# EAGLE board EEG_v2_0 (EAGLE 9.5.2), part 1 of 2
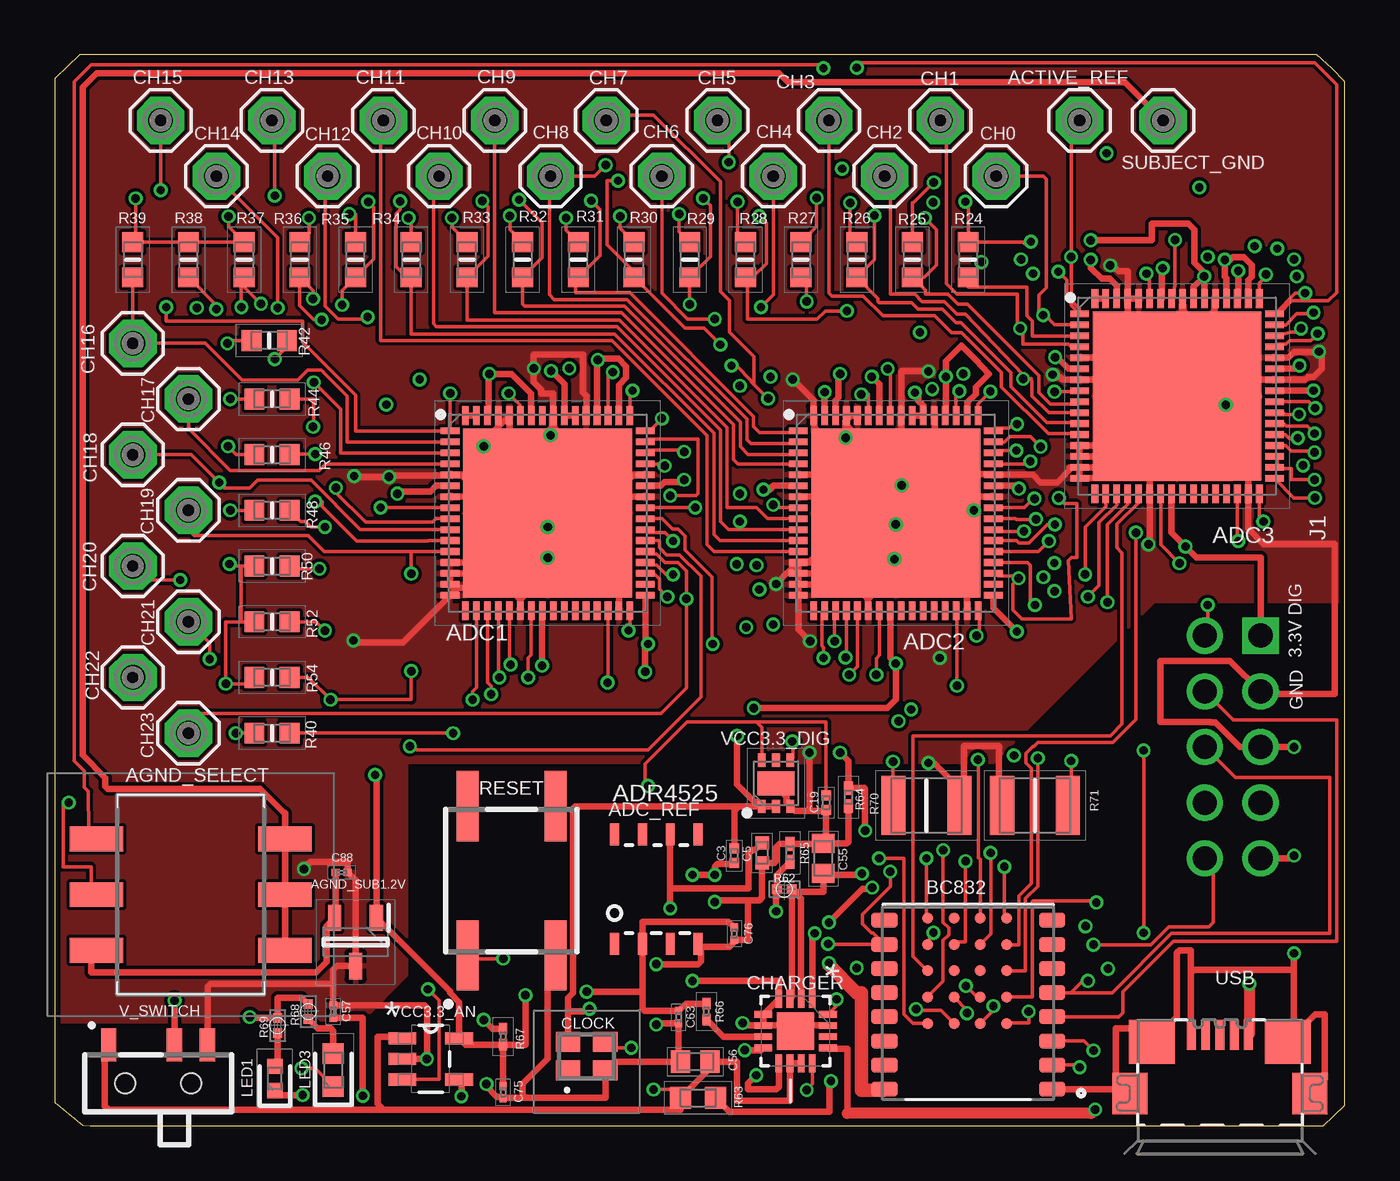
[diagram p2: board, top side]
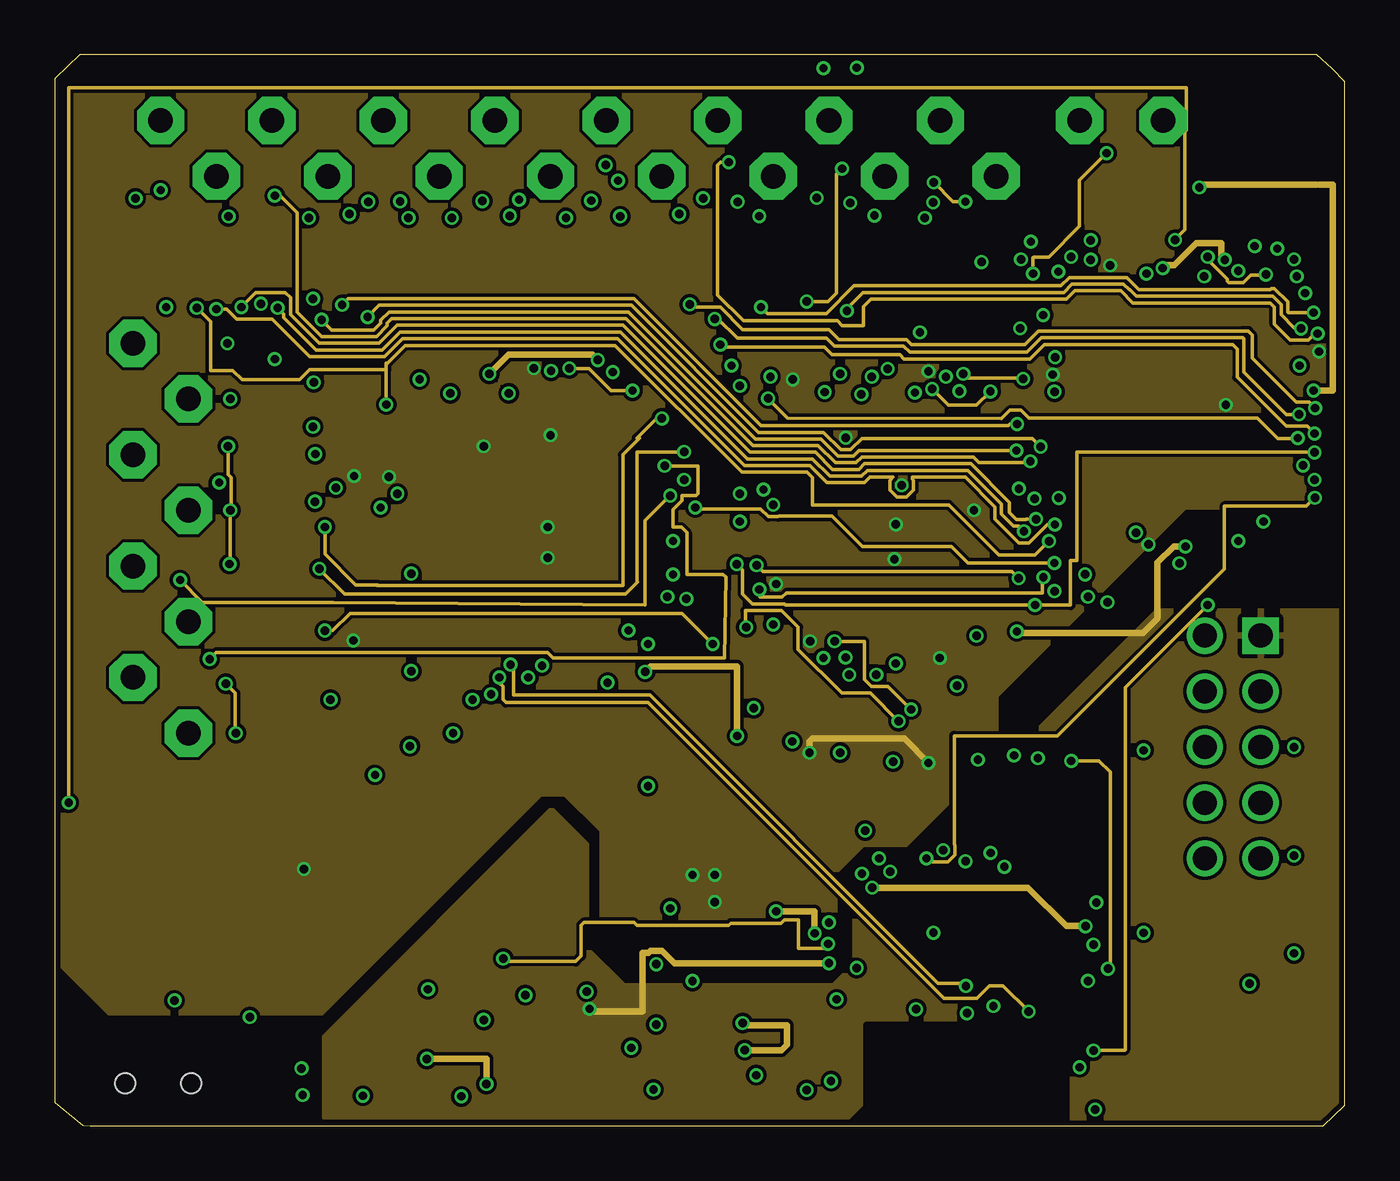
[diagram p3: board, inner layer Route2]
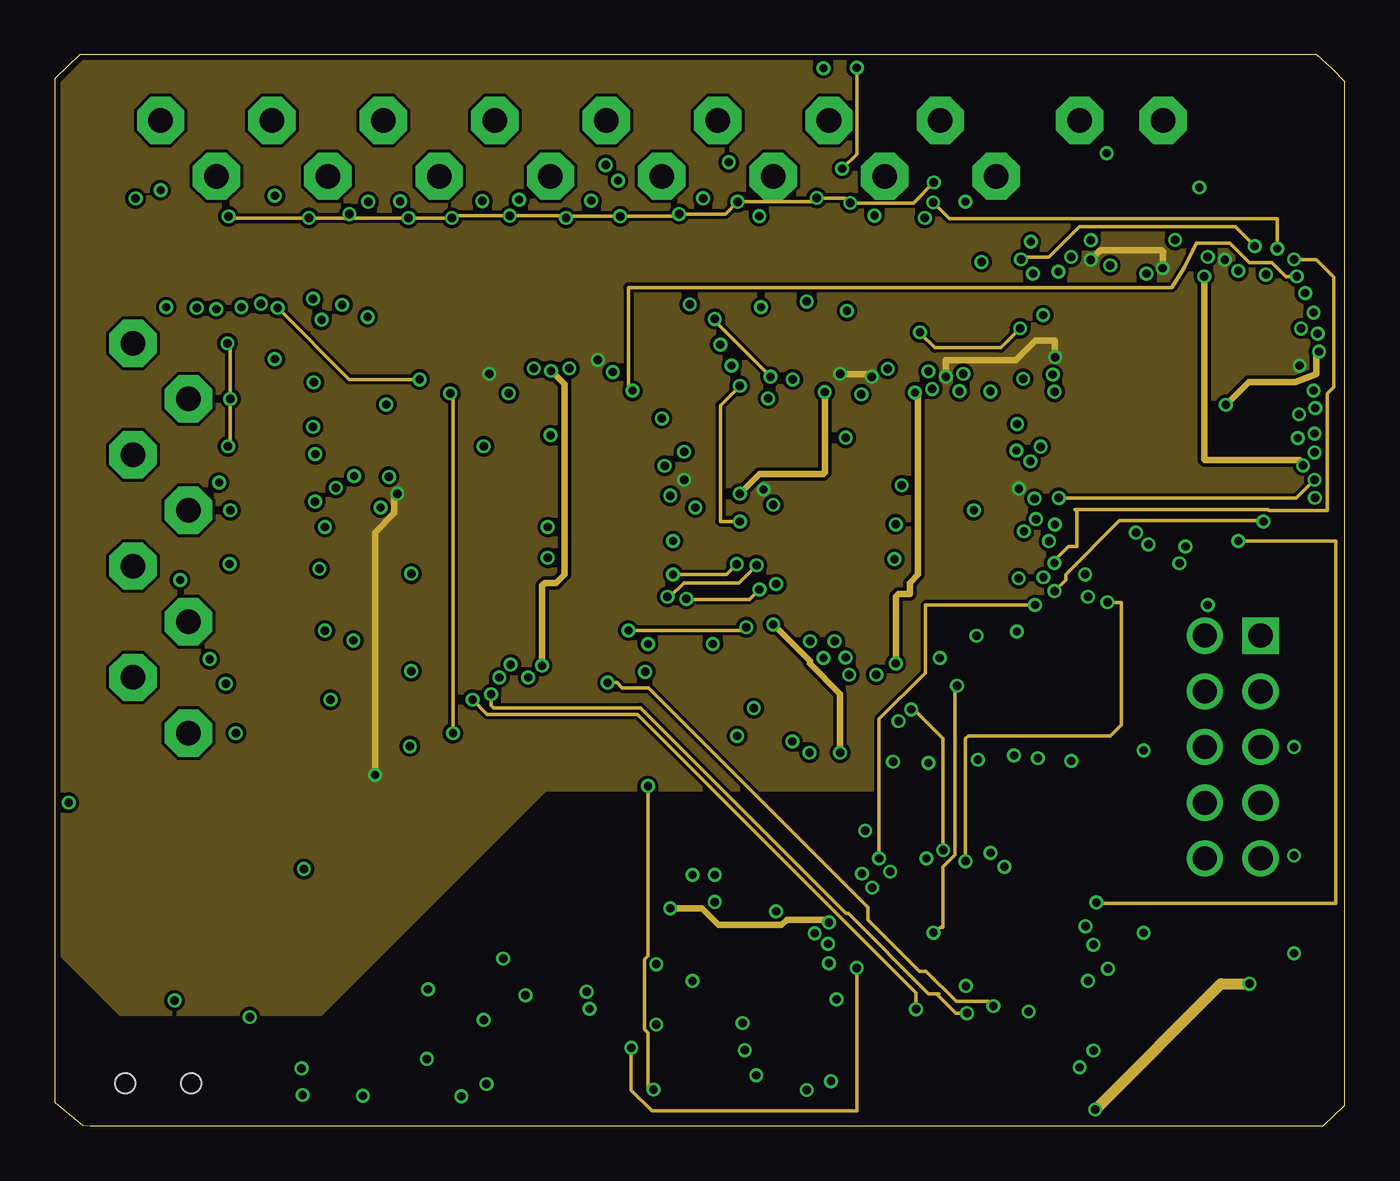
[diagram p4: board, inner layer Route15]
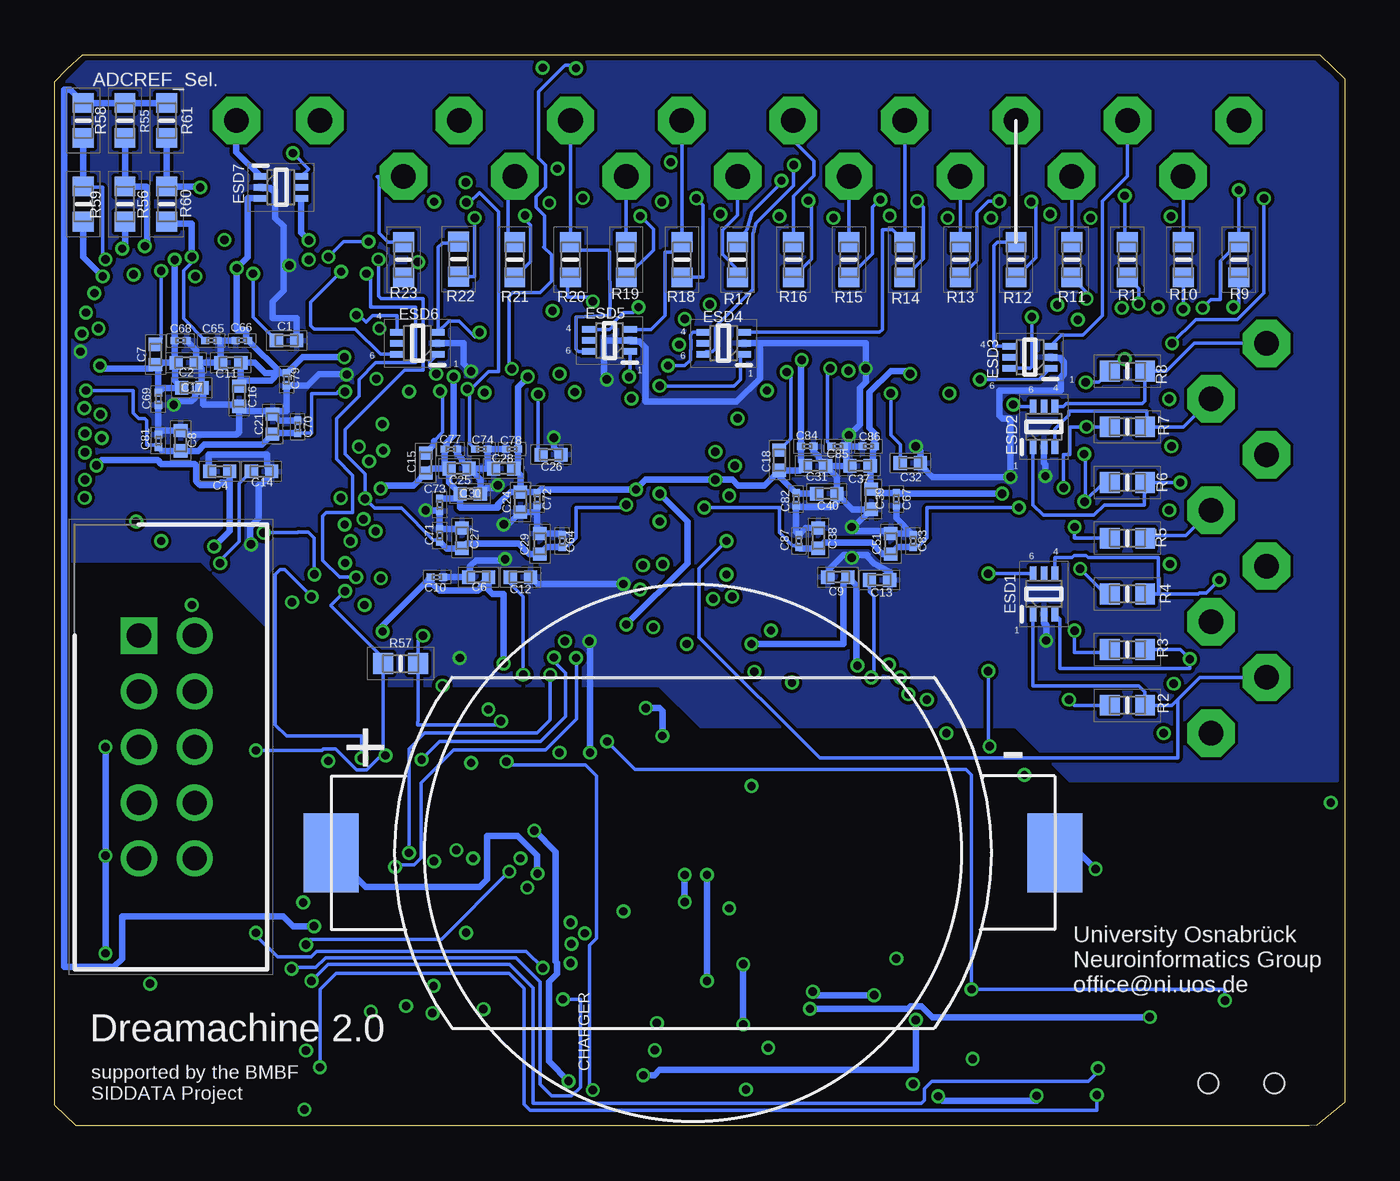
[diagram p5: board, bottom side, seen from below]

Size 58.83 x 48.84 mm. Coordinates in mm from the lower left corner, seen from the top.
Outline: 0,1.07 1.27,0.03 1.63,0 57.86,0 58.83,0.94 58.83,47.62 58.27,48.21 57.56,48.84 1.14,48.84 0,47.75 0,1.07
Copper layers (1+2*15+16): Top 0.018mm / dielectric 0.36mm / Route2 0.035mm / dielectric 0.71mm / Route15 0.035mm / dielectric 0.2mm / Bottom 0.018mm
Design rules "eC_4Layer_PClass6_BaseCopperO18-I35_eCDefault *": minimum track width 0.15mm, minimum drill 0.35mm, track to track 0.15mm, track to pad 0.15mm, pad to pad 0.15mm, via to via 0.15mm, smd to smd 0mil, copper to edge 0.25mm, drill to drill 0.35mm, minimum pad ring 0.175mm, minimum via ring 0.125mm, stop-mask expansion 0mil, vias tented up to drill 0.45mm, thermal gap 0.2mm
Net classes: 0 default: width 0.152 mm, drill 0.381 mm; 1 power: width 0.305 mm, drill 0.381 mm; 2 power2: width 0.305 mm, drill 0.381 mm

## Footprints (pad centres in the part's own frame; a part is rotated, then mirrored left to right if it is on the bottom)
SE11 = drill 1.118 pad 2.159 octagon: MP 0,0
QFN50P900X900X80-65N = smd 0.85 x 0.3: 1 -4.45,3.75; 2 -4.45,3.25; 3 -4.45,2.75; 4 -4.45,2.25; 5 -4.45,1.75; 6 -4.45,1.25; 7 -4.45,0.75; 8 -4.45,0.25; 9 -4.45,-0.25; 10 -4.45,-0.75; 11 -4.45,-1.25; 12 -4.45,-1.75; 13 -4.45,-2.25; 14 -4.45,-2.75; 15 -4.45,-3.25; 16 -4.45,-3.75; 33 4.45,-3.75; 34 4.45,-3.25; 35 4.45,-2.75; 36 4.45,-2.25; 37 4.45,-1.75; 38 4.45,-1.25; 39 4.45,-0.75; 40 4.45,-0.25; 41 4.45,0.25; 42 4.45,0.75; 43 4.45,1.25; 44 4.45,1.75; 45 4.45,2.25; 46 4.45,2.75; 47 4.45,3.25; 48 4.45,3.75 | smd 0.3 x 0.85: 17 -3.75,-4.45; 18 -3.25,-4.45; 19 -2.75,-4.45; 20 -2.25,-4.45; 21 -1.75,-4.45; 22 -1.25,-4.45; 23 -0.75,-4.45; 24 -0.25,-4.45; 25 0.25,-4.45; 26 0.75,-4.45; 27 1.25,-4.45; 28 1.75,-4.45; 29 2.25,-4.45; 30 2.75,-4.45; 31 3.25,-4.45; 32 3.75,-4.45; 49 3.75,4.45; 50 3.25,4.45; 51 2.75,4.45; 52 2.25,4.45; 53 1.75,4.45; 54 1.25,4.45; 55 0.75,4.45; 56 0.25,4.45; 57 -0.25,4.45; 58 -0.75,4.45; 59 -1.25,4.45; 60 -1.75,4.45; 61 -2.25,4.45; 62 -2.75,4.45; 63 -3.25,4.45; 64 -3.75,4.45 | smd 7.7 x 7.7: 65 0,0
SMTU2477N-LF = smd 2.5 x 3.6: GND 16.5,0; POS -16.5,0
SOIC-8 = smd 0.4 x 1: 1 -1.905,-2.5; 2 -0.635,-2.5; 3 0.635,-2.5; 4 1.905,-2.5; 5 1.905,2.5; 6 0.635,2.5; 7 -0.635,2.5; 8 -1.905,2.5
2193LPSTR = smd 1.13 x 2.44: 1 -2.54,-4.305; 2 0,-4.305; 3 2.54,-4.305; 4 2.54,4.305; 5 0,4.305; 6 -2.54,4.305
SOT95P237X112-3N = smd 1.2 x 0.6: 1 -1.1,0.95; 2 -1.1,-0.95; 3 1.1,0
XCVR_BC832 = smd 1.19 x 0.69: 1 -3.82,3.918; 2 -3.82,2.818; 3 -3.82,1.718; 4 -3.82,0.618; 5 -3.82,-0.482; 6 -3.82,-1.582; 7 -3.82,-2.682; 8 -3.82,-3.782; 9 3.82,-3.782; 10 3.82,-2.682; 11 3.82,-1.582; 12 3.82,-0.482; 13 3.82,0.618; 14 3.82,1.718; 15 3.82,2.818; 16 3.82,3.918 | smd 0.5 x 0.5: A1 -1.75,0.919; A2 -1.75,-0.281; A3 -1.75,-1.481; A4 -1.75,-2.681; A5 -1.75,-3.881; B1 -0.55,0.919; B2 -0.55,-0.281; B3 -0.55,-1.481; B4 -0.55,-2.681; B5 -0.55,-3.881; C1 0.65,0.919; C2 0.65,-0.281; C3 0.65,-1.481; C4 0.65,-2.681; C5 0.65,-3.881; D1 1.85,0.919; D2 1.85,-0.281; D3 1.85,-1.481; D4 1.85,-2.681; D5 1.85,-3.881
CAPC1005X33N = smd 0.6 x 0.62: 1 -0.46,0; 2 0.46,0
CAPC0603X33N = smd 0.46 x 0.42: 1 -0.33,0; 2 0.33,0
CAPC0402X22N = smd 0.365 x 0.33: 1 -0.282,0; 2 0.282,0
CAPC1608X100N = smd 0.87 x 1.02: 1 -0.68,0; 2 0.68,0
QFN50P300X300X100-17N = smd 0.813 x 0.305: 1 -1.473,0.762; 2 -1.473,0.254; 3 -1.473,-0.254; 4 -1.473,-0.762; 9 1.473,-0.762; 10 1.473,-0.254; 11 1.473,0.254; 12 1.473,0.762 | smd 0.305 x 0.813: 5 -0.762,-1.473; 6 -0.254,-1.473; 7 0.254,-1.473; 8 0.762,-1.473; 13 0.762,1.473; 14 0.254,1.473; 15 -0.254,1.473; 16 -0.762,1.473 | smd 1.702 x 1.702: 17 0,0
SG210STF80000MY3 = smd 1.1 x 0.9: 1 -0.85,-0.65; 2 0.85,-0.65; 3 0.85,0.65; 4 -0.85,0.65
SOP50P160X60-6N = smd 0.65 x 0.3: 1 -0.925,0.5; 2 -0.925,0; 3 -0.925,-0.5; 4 0.925,-0.5; 5 0.925,0; 6 0.925,0.5
SHDR10W64P254_2X5_2030X878X930 = drill 1.1 pad 1.65 square: 1 0,0 | drill 1.1 pad 1.65: 2 0,2.54; 3 2.54,0; 4 2.54,2.54; 5 5.08,0; 6 5.08,2.54; 7 7.62,0; 8 7.62,2.54; 9 10.16,0; 10 10.16,2.54
LEDC1006X25N = smd 0.7 x 0.7: 1 -0.55,0; 2 0.55,0
LEDC1608X80N = smd 0.95 x 0.95: 1 -0.75,0; 2 0.75,0
RESC1608X55N = smd 0.9 x 0.95: 1 -0.8,0; 2 0.8,0
RESC0603X26N = smd 0.44 x 0.42: 1 -0.34,0; 2 0.34,0
RESC1608X55N' = smd 0.95 x 1: 1 -0.8,0; 2 0.8,0
RESC0603X28N = smd 0.625 x 0.4: 1 -0.412,0; 2 0.412,0
RESC0402X15N = smd 0.525 x 0.35: 1 -0.362,0; 2 0.362,0
RESC3225X70N = smd 1.1 x 2.7: 1 -1.5,0; 2 1.5,0
EVQQ2 = smd 3.2 x 1: 1 -3.4,2; 2 -3.4,-2; 3 3.4,-2; 4 3.4,2
ZX62R-B-5P = smd 1.35 x 0.4: 1 2.675,-1.3; 2 2.675,-0.65; 3 2.675,0; 4 2.675,0.65; 5 2.675,1.3 | smd 1.9 x 1.6: M1 0,-4.1; M2 0,4.1 | smd 2 x 2.1: M3 2.35,3.1; M4 2.35,-3.1
SSSS810701 = smd 0.7 x 1.5: 1 -3,0; 2 0,0; 3 1.5,0 | hole 0.9: -2.25,-1.75; 0.75,-1.75
SOT95P280X145-5N = smd 1.27 x 0.559: 1 -1.295,0.94; 2 -1.295,0; 3 -1.295,-0.94; 4 1.295,-0.94; 5 1.295,0.94
SON65P200X200X65-7N = smd 0.6 x 0.35: 1 -1.05,0.65; 2 -1.05,0; 3 -1.05,-0.65; 4 1.05,-0.65; 5 1.05,0; 6 1.05,0.65 | smd 1.1 x 1.7: 7 0,0

## Placement (x,y rotation side)
ACTIVE_REF  SE11  [SE11]  46.74,45.85 0 top
ADC1  AD7771BCPZ  [QFN50P900X900X80-65N]  22.48,27.94 0 top
ADC2  AD7771BCPZ  [QFN50P900X900X80-65N]  38.35,27.94 0 top
ADC3  AD7771BCPZ  [QFN50P900X900X80-65N]  51.18,33.27 0 top
ADC_REF  SMTU2477N-LF  [SMTU2477N-LF]  29.72,12.45 0 bottom
ADR4525  ADR4525  [SOIC-8]  27.43,10.8 0 top
AGND_SELECT  219-3LPSTR  [2193LPSTR]  6.2,10.54 270 top
AGND_SUB1.2V  ISL21010DFH312Z-TK  [SOT95P237X112-3N]  13.72,8.38 270 top
BC832  BC832  [XCVR_BC832]  41.66,5.59 180 top
C1  1 uF  [CAPC1005X33N]  48.26,35.81 0 bottom
C2  1 uF  [CAPC1005X33N]  52.83,34.8 180 bottom
C3  2.2uF  [CAPC0603X33N]  30.99,12.32 90 top
C4  1 uF  [CAPC1005X33N]  51.31,29.84 180 bottom
C5  1 uF  [CAPC1005X33N]  32.26,12.45 270 top
C6  1 uF  [CAPC1005X33N]  39.5,25.02 180 bottom
C7  1 uF  [CAPC1005X33N]  54.23,35.18 270 bottom
C8  1 uF  [CAPC1005X33N]  53.09,31.24 90 bottom
C9  1 uF  [CAPC1005X33N]  23.11,25.02 180 bottom
C10  0.01uF  [CAPC0402X22N]  41.4,25.02 180 bottom
C11  1 uF  [CAPC1005X33N]  50.8,34.8 180 bottom
C12  1 uF  [CAPC1005X33N]  37.59,25.02 180 bottom
C13  1 uF  [CAPC1005X33N]  21.21,24.89 180 bottom
C14  1 uF  [CAPC1005X33N]  49.4,29.84 0 bottom
C15  1 uF  [CAPC1005X33N]  41.91,30.23 270 bottom
C16  1 uF  [CAPC1005X33N]  50.42,33.27 90 bottom
C17  1 uF  [CAPC1005X33N]  52.58,33.66 180 bottom
C18  1 uF  [CAPC1005X33N]  25.78,30.35 270 bottom
C19  2.2uF  [CAPC0603X33N]  35.18,14.73 90 top
C21  1 uF  [CAPC1005X33N]  48.9,32 270 bottom
C24  1 uF  [CAPC1005X33N]  37.59,28.45 90 bottom
C25  1 uF  [CAPC1005X33N]  40.39,29.97 180 bottom
C26  1 uF  [CAPC1005X33N]  36.2,30.61 0 bottom
C27  1 uF  [CAPC1005X33N]  40.26,26.8 90 bottom
C28  1 uF  [CAPC1005X33N]  38.35,29.97 180 bottom
C29  1 uF  [CAPC1005X33N]  36.7,26.54 270 bottom
C30  1 uF  [CAPC1005X33N]  39.88,28.83 180 bottom
C31  1 uF  [CAPC1005X33N]  24.13,30.1 180 bottom
C32  1 uF  [CAPC1005X33N]  19.81,30.23 0 bottom
C37  1 uF  [CAPC1005X33N]  22.1,30.1 180 bottom
C38  1 uF  [CAPC1005X33N]  24,26.8 90 bottom
C39  1 uF  [CAPC1005X33N]  21.59,28.58 90 bottom
C40  1 uF  [CAPC1005X33N]  23.62,28.83 180 bottom
C51  1 uF  [CAPC1005X33N]  20.7,26.54 270 bottom
C55  10 uF  [CAPC1608X100N]  35.05,12.19 270 top
C56  10 uF  [CAPC1608X100N]  29.21,2.92 0 top
C57  0.01uF  [CAPC0402X22N]  12.7,5.21 90 top
C63  0.1 uF  [CAPC0402X22N]  28.45,4.95 270 top
C64  0.1 uF  [CAPC0402X22N]  35.69,26.67 270 bottom
C65  0.1 uF  [CAPC0402X22N]  51.69,35.81 180 bottom
C66  0.1 uF  [CAPC0402X22N]  50.29,35.81 180 bottom
C67  0.1 uF  [CAPC0402X22N]  20.45,28.58 90 bottom
C68  0.1 uF  [CAPC0402X22N]  53.09,35.81 180 bottom
C69  0.1 uF  [CAPC0402X22N]  54.1,33.15 90 bottom
C70  0.1 uF  [CAPC0402X22N]  47.75,31.88 270 bottom
C71  0.1 uF  [CAPC0402X22N]  41.28,26.92 90 bottom
C72  0.1 uF  [CAPC0402X22N]  36.83,28.58 90 bottom
C73  0.1 uF  [CAPC0402X22N]  41.28,28.32 90 bottom
C74  0.1 uF  [CAPC0402X22N]  39.37,30.86 180 bottom
C75  1 uF  [CAPC0402X22N]  20.45,1.52 90 top
C76  0.1 uF  [CAPC0402X22N]  30.99,8.76 270 top
C77  0.1 uF  [CAPC0402X22N]  40.77,30.86 180 bottom
C78  0.1 uF  [CAPC0402X22N]  37.97,30.86 180 bottom
C79  0.1 uF  [CAPC0402X22N]  48.26,34.04 90 bottom
C81  0.1 uF  [CAPC0402X22N]  54.1,31.24 90 bottom
C82  0.1 uF  [CAPC0402X22N]  25.02,28.58 90 bottom
C83  0.1 uF  [CAPC0402X22N]  19.69,26.67 270 bottom
C84  0.1 uF  [CAPC0402X22N]  24.51,30.99 180 bottom
C85  0.1 uF  [CAPC0402X22N]  23.11,30.99 180 bottom
C86  0.1 uF  [CAPC0402X22N]  21.72,30.99 180 bottom
C87  0.1 uF  [CAPC0402X22N]  24.89,26.67 90 bottom
C88  0.1 uF  [CAPC0402X22N]  13.08,11.56 180 top
CH0  SE11  [SE11]  42.93,43.31 0 top
CH1  SE11  [SE11]  40.39,45.85 0 top
CH2  SE11  [SE11]  37.85,43.31 0 top
CH3  SE11  [SE11]  35.31,45.85 0 top
CH4  SE11  [SE11]  32.77,43.31 0 top
CH5  SE11  [SE11]  30.23,45.85 0 top
CH6  SE11  [SE11]  27.69,43.31 0 top
CH7  SE11  [SE11]  25.15,45.85 0 top
CH8  SE11  [SE11]  22.61,43.31 0 top
CH9  SE11  [SE11]  20.07,45.85 0 top
CH10  SE11  [SE11]  17.53,43.31 0 top
CH11  SE11  [SE11]  14.99,45.85 0 top
CH12  SE11  [SE11]  12.45,43.31 0 top
CH13  SE11  [SE11]  9.91,45.85 0 top
CH14  SE11  [SE11]  7.37,43.31 0 top
CH15  SE11  [SE11]  4.83,45.85 0 top
CH16  SE11  [SE11]  3.56,35.69 0 top
CH17  SE11  [SE11]  6.1,33.15 0 top
CH18  SE11  [SE11]  3.56,30.61 0 top
CH19  SE11  [SE11]  6.1,28.07 0 top
CH20  SE11  [SE11]  3.56,25.53 0 top
CH21  SE11  [SE11]  6.1,22.99 0 top
CH22  SE11  [SE11]  3.56,20.45 0 top
CH23  SE11  [SE11]  6.1,17.91 0 top
CHARGER  BQ24072TRGTR  [QFN50P300X300X100-17N]  33.78,4.32 270 top
CLOCK  SG-210STF 8.1920ML3  [SG210STF80000MY3]  24.26,3.17 0 top
ESD1  TPD4E1B06DRLR  [SOP50P160X60-6N]  13.72,24.26 90 bottom
ESD2  TPD4E1B06DRLR  [SOP50P160X60-6N]  13.72,31.88 90 bottom
ESD3  TPD4E1B06DRLR  [SOP50P160X60-6N]  14.35,35.05 180 bottom
ESD4  TPD4E1B06DRLR  [SOP50P160X60-6N]  28.32,35.69 180 bottom
ESD5  TPD4E1B06DRLR  [SOP50P160X60-6N]  33.53,35.81 180 bottom
ESD6  TPD4E1B06DRLR  [SOP50P160X60-6N]  42.29,35.69 180 bottom
ESD7  TPD4E1B06DRLR  [SOP50P160X60-6N]  48.51,42.8 0 bottom
J1  30310-6002HB  [SHDR10W64P254_2X5_2030X878X930]  54.99,22.35 270 bottom
LED1  SML-P11MTT86R  [LEDC1006X25N]  10.03,2.16 90 top
LED3  150060RS75000  [LEDC1608X80N]  12.7,2.54 90 top
R1  0 Ohm  [RESC1608X55N]  9.91,39.5 270 bottom
R2  0 Ohm  [RESC1608X55N]  9.91,19.18 180 bottom
R3  0 Ohm  [RESC1608X55N]  9.91,21.72 180 bottom
R4  0 Ohm  [RESC1608X55N]  9.91,24.26 180 bottom
R5  0 Ohm  [RESC1608X55N]  9.91,26.8 180 bottom
R6  0 Ohm  [RESC1608X55N]  9.91,29.34 180 bottom
R7  0 Ohm  [RESC1608X55N]  9.91,31.88 180 bottom
R8  0 Ohm  [RESC1608X55N]  9.91,34.42 180 bottom
R9  0 Ohm  [RESC1608X55N]  4.83,39.5 270 bottom
R10  0 Ohm  [RESC1608X55N]  7.37,39.5 270 bottom
R11  0 Ohm  [RESC1608X55N]  12.45,39.5 270 bottom
R12  0 Ohm  [RESC1608X55N]  14.99,39.5 270 bottom
R13  0 Ohm  [RESC1608X55N]  17.53,39.5 270 bottom
R14  0 Ohm  [RESC1608X55N]  20.07,39.5 270 bottom
R15  0 Ohm  [RESC1608X55N]  22.61,39.5 270 bottom
R16  0 Ohm  [RESC1608X55N]  25.15,39.5 270 bottom
R17  0 Ohm  [RESC1608X55N]  27.69,39.5 90 bottom
R18  0 Ohm  [RESC1608X55N]  30.23,39.5 270 bottom
R19  0 Ohm  [RESC1608X55N]  32.77,39.5 270 bottom
R20  0 Ohm  [RESC1608X55N]  35.31,39.5 270 bottom
R21  0 Ohm  [RESC1608X55N]  37.85,39.5 270 bottom
R22  0 Ohm  [RESC1608X55N]  40.41,39.52 270 bottom
R23  0 Ohm  [RESC1608X55N]  42.93,39.5 270 bottom
R24  0 Ohm  [RESC1608X55N]  41.66,39.5 270 top
R25  0 Ohm  [RESC1608X55N]  39.12,39.5 270 top
R26  0 Ohm  [RESC1608X55N]  36.58,39.5 270 top
R27  0 Ohm  [RESC1608X55N]  34.04,39.5 270 top
R28  0 Ohm  [RESC1608X55N]  31.5,39.5 270 top
R29  0 Ohm  [RESC1608X55N]  28.96,39.5 270 top
R30  0 Ohm  [RESC1608X55N]  26.42,39.5 270 top
R31  0 Ohm  [RESC1608X55N]  23.88,39.5 270 top
R32  0 Ohm  [RESC1608X55N]  21.34,39.5 270 top
R33  0 Ohm  [RESC1608X55N]  18.8,39.5 270 top
R34  0 Ohm  [RESC1608X55N]  16.26,39.5 270 top
R35  0 Ohm  [RESC1608X55N]  13.72,39.5 270 top
R36  0 Ohm  [RESC1608X55N]  11.18,39.5 270 top
R37  0 Ohm  [RESC1608X55N]  8.64,39.5 270 top
R38  0 Ohm  [RESC1608X55N]  6.1,39.5 270 top
R39  0 Ohm  [RESC1608X55N]  3.56,39.5 270 top
R40  0 Ohm  [RESC1608X55N]  9.91,17.91 0 top
R42  0 Ohm  [RESC1608X55N]  9.78,35.81 0 top
R44  0 Ohm  [RESC1608X55N]  9.91,33.15 0 top
R46  0 Ohm  [RESC1608X55N]  9.91,30.61 0 top
R48  0 Ohm  [RESC1608X55N]  9.91,28.07 0 top
R50  0 Ohm  [RESC1608X55N]  9.91,25.53 0 top
R52  0 Ohm  [RESC1608X55N]  9.91,22.99 0 top
R54  0 Ohm  [RESC1608X55N]  9.91,20.45 0 top
R55  0 Ohm  [RESC1608X55N]  55.63,45.85 90 bottom
R56  0 Ohm  [RESC1608X55N]  55.63,42.04 270 bottom
R57  0 Ohm  [RESC1608X55N]  43.05,21.08 0 bottom
R58  0 Ohm  [RESC1608X55N]  57.53,45.85 90 bottom
R59  0 Ohm  [RESC1608X55N]  57.53,42.04 270 bottom
R60  0 Ohm  [RESC1608X55N]  53.72,42.04 270 bottom
R61  0 Ohm  [RESC1608X55N]  53.72,45.85 90 bottom
R62  191kohm  [RESC0603X26N]  33.27,10.8 0 top
R63  82kOhms  [RESC1608X55N']  29.34,1.27 180 top
R64  41 kOhms  [RESC0603X28N]  36.2,14.99 90 top
R65  41 kOhms  [RESC0603X28N]  33.53,12.45 270 top
R66  10 kOhms  [RESC0402X15N]  29.72,5.21 270 top
R67  10 kOhms  [RESC0402X15N]  20.45,4.06 90 top
R68  1 kohm  [RESC0603X26N]  11.56,5.21 90 top
R69  1 kohm  [RESC0603X26N]  10.16,4.57 90 top
R70  2.2 kOhms  [RESC3225X70N]  39.75,14.61 180 top
R71  2.2 kOhms  [RESC3225X70N]  44.7,14.61 0 top
RESET  EVQ-Q2B03W  [EVQQ2]  20.83,11.18 90 top
SUBJECT_GND  SE11  [SE11]  50.55,45.85 0 top
USB  MICRO-USB-SHIELD-ZX62R-B-5P  [ZX62R-B-5P]  53.14,1.47 90 top
V_SWITCH  SSSS810701  [SSSS810701]  5.46,3.68 0 top
VCC3.3_AN  TPS73233DBVT  [SOT95P280X145-5N]  17.15,3.05 0 top
VCC3.3_DIG  ADP7118ACPZN3.3-R7  [SON65P200X200X65-7N]  32.89,15.62 90 top

## Tracks (layer width: path | path; a pad name or v marks a point on that pad's centre or on a via)
-CHG  (via drill 0.38)
  Top 0.305: CHARGER.9 33.02,1.78 32.89,1.65 31.62,1.65 31.62,1.94 v31.99,2.3 | v19.56,4.83 19.96,4.43 R67.2
  Bottom 0.305: v31.99,2.3 31.48,2.3 31.24,2.54 19.56,2.54 v19.56,4.83
-PGOOD
  Top 0.305: R66.2 30.5,4.06 CHARGER.7
ADC1_IN_0+  (via drill 0.38)
  Top 0.152: ADC3.2 46.71,36.55 45.6,36.55 45.17,36.97 v45.07,36.97 44.88,36.97 44.88,37.89 45.21,38.23 45.21,43.18 45.09,43.31 CH0.MP
  Bottom 0.152: CH0.MP 44.12,43.28 44.04,43.2 44.04,40.72 43.62,40.3 R23.1 | ESD6.4 43.22,36.96 44.32,36.96 44.64,36.64 44.97,36.97 v45.07,36.97
ADC1_IN_0-  (via drill 0.38)
  Top 0.152: ACTIVE_REF.MP 46.35,45.46 v46.35,39.62 46.35,37.41 ADC3.1 46.73,37.28 46.15,37.86 46.15,38.58 v45.77,38.96 | R39.1 3.68,40.3 | 3.68,40.3 R38.1 R37.1 7.92,41.01 v7.92,41.48 | R36.1 11.59,40.71 v11.59,41.4 | R35.1 13.72,41.58 v13.44,41.58 | R34.1 16.26,41.27 v16.13,41.4 | R33.1 18.11,40.98 v18.11,41.4 | R32.1 20.75,40.88 v20.75,41.5 | v23.32,41.4 23.32,40.86 R31.1 | v25.78,41.48 25.78,40.93 R30.1 | v28.47,41.58 28.47,40.78 R29.1 | R28.1 31.14,40.65 v31.14,42.14 | v34.75,42.32 34.75,41.01 R27.1 | v36.27,42.09 36.27,40.6 R26.1 | R25.1 39.12,42.1 39.16,42.1 v40.09,43.03 | v41.53,42.15 41.55,42.15 41.66,42.04 R24.1 44.16,40.3 44.32,40.13 v44.51,40.32 | v3.68,42.29 3.68,40.3 | 8.51,22.99 7.8,22.99 v7.8,20.16 8.82,20.16 R54.1 | 8.51,22.99 R52.1 | 8.51,22.99 8.51,25.53 | 8.51,25.53 8.06,25.53 v7.97,25.62 | 8.51,25.53 R50.1 | R40.1 v8.26,17.91 | R48.1 v8,28.07 | R46.1 8.28,30.61 v7.9,30.99 | R42.1 8,35.81 v7.87,35.69 | R44.1 v8,33.15
  Route2 0.152: v40.09,43.03 40.97,42.15 v41.53,42.15 | v7.8,20.16 8.23,19.73 8.23,17.93 v8.26,17.91 | v8,28.07 8,27.94 | 8,27.94 8,25.65 v7.97,25.62 | v7.9,30.99 7.9,29.7 8.04,29.56 8.04,27.97 8,27.94
  Route15 0.152: v7.92,41.48 8,41.4 v11.59,41.4 13.26,41.4 v13.44,41.58 13.61,41.4 v16.13,41.4 v18.11,41.4 18.21,41.5 v20.75,41.5 23.22,41.5 v23.32,41.4 23.39,41.48 v25.78,41.48 28.37,41.48 v28.47,41.58 30.58,41.58 v31.14,42.14 34.57,42.14 v34.75,42.32 36.04,42.32 v36.27,42.09 39.15,42.09 v40.09,43.03 | v7.87,35.69 8,35.56 v8,33.15 8,31.09 v7.9,30.99
  Bottom 0.152: v44.51,40.32 45.65,40.32 v46.35,39.62 | v7.87,35.69 6.8,36.76 4.89,36.76 3.68,37.97 v3.68,42.29 | ESD6.6 43.98,35.19 45.12,36.33 47,36.33 47.17,36.5 47.17,37.56 v45.77,38.96
ADC1_IN_1+  (via drill 0.38)
  Top 0.152: CH1.MP 40.66,45.57 40.66,38.41 41.15,37.93 43.9,37.93 43.9,36.49 v44.02,36.37 44.15,36.24 44.15,35.65 46.22,35.65 46.35,35.52 ADC3.4
  Route15 0.152: v44.02,36.37 43.14,35.49 40.13,35.49 39.45,36.16 v39.45,36.18
  Bottom 0.152: R22.1 40.48,40.26 41.15,40.26 41.34,40.07 41.34,36.22 ESD6.3 40.85,36.7 40.39,36.7 39.66,35.98 v39.45,36.18
ADC1_IN_1-  (via drill 0.38)
  Top 0.152: ADC3.3 44.58,36.02 44.58,36.7 44.32,36.96 44.32,38.26 41.66,38.26 R24.2 42.27,39.31 v42.27,39.4
  Bottom 0.152: R23.2 42.93,38.73 v42.27,39.4
ADC1_IN_2+  (via drill 0.38)
  Top 0.152: CH2.MP 38.1,43.05 38.1,37.92 39.22,37.92 39.55,37.59 40.57,37.59 41.15,37.01 41.54,37.01 44.16,34.23 v44.16,34.07 44.54,34.07 44.5,34.03 44.57,33.96 44.57,33.28 45.33,32.52 ADC3.10
  Route2 0.152: v44.16,34.07 44.14,34.09 41.64,34.09 v41.43,34.3
  Bottom 0.152: CH2.MP 38.15,43 38.15,40.6 R21.1 | ESD6.1 41.73,34.82 41.73,34.6 v41.43,34.3
ADC1_IN_2-  (via drill 0.38)
  Top 0.152: ADC3.9 46.62,32.91 45.39,32.91 44.87,33.43 44.87,34.22 41.63,37.47 41.18,37.47 40.72,37.92 39.7,37.92 39.7,38.11 R25.2 39.65,38.7 40.21,39.26 40.21,40.87 v39.68,41.4
  Bottom 0.152: R22.2 39.68,38.72 v39.68,41.4
ADC1_IN_3+
  Top 0.152: ADC3.12 46.68,31.57 45.31,31.57 43.18,33.68 43.18,34.34 41.35,36.17 40.89,36.17 40.12,36.94 37.77,36.94 36.86,37.85 35.43,37.85 35.31,37.97 CH3.MP
  Bottom 0.152: CH3.MP R20.1 35.31,39.94 33.59,39.94 33.53,39.88 33.52,37.22 33.53,37.21 33.53,36.97 35.05,36.87 35.05,35.43 34.93,35.31 ESD5.6
ADC1_IN_3-  (via drill 0.38)
  Top 0.152: ADC3.11 46.68,32.08 45.23,32.08 43.61,33.7 43.61,34.34 41.32,36.63 41.09,36.63 40.48,37.24 39.37,37.24 39.07,37.54 37.59,37.54 37.54,37.59 37.54,37.73 R26.2 37.38,39.5 v37.38,41.51
  Bottom 0.152: R21.2 37.14,39.41 37.14,41.07 37.38,41.32 v37.38,41.51
ADC1_IN_4+  (via drill 0.38)
  Top 0.152: ADC3.47 56.14,36.52 56.65,37.03 57.35,37.03 v57.4,37.08 | v32.21,37.34 32.77,37.9 CH4.MP
  Route2 0.152: v57.4,37.08 56.26,37.08 56.23,37.11 56.23,37.58 55.62,38.19 55.49,38.19 55.44,38.13 49.45,38.13 48.9,38.68 46.26,38.68 45.88,38.31 36.45,38.31 35.2,37.05 32.5,37.05 v32.21,37.34
  Bottom 0.152: CH4.MP R19.1 | ESD5.4 33.54,36.31 33.4,36.45 33.4,36.58 32.89,37.08 32.46,37.08 v32.21,37.34
ADC1_IN_4-  (via drill 0.38)
  Top 0.152: R27.2 34.29,38.44 v34.29,37.59 | v57.02,37.97 56.58,37.97 ADC3.48 55.82,37.02 56.42,37.63 58.07,37.63 58.46,38.01 58.47,47.47 57.46,48.49 57.44,48.49 36.58,48.49 v36.58,48.25
  Route2 0.152: v34.29,37.59 35.26,37.59 35.65,37.97 35.65,43.4 v35.91,43.65
  Route15 0.152: v36.58,48.25 36.58,44.32 v35.91,43.65
  Bottom 0.152: v34.29,37.59 34.5,37.8 35.43,37.8 35.43,38.57 R20.2
ADC1_IN_5+  (via drill 0.38)
  Top 0.152: v30.74,43.94 30.74,45.34 CH5.MP | ADC3.45 55.76,35.65 56.15,35.65 56.32,35.81 57.28,35.81 v57.6,36.13
  Route2 0.152: v57.6,36.13 57.47,36.13 57.16,35.82 56.35,35.82 55.62,36.55 55.62,37.33 55.42,37.52 49.17,37.52 48.62,38.08 46.51,38.08 46.14,37.7 37.21,37.7 36.88,37.37 36.88,36.5 35.9,36.5 35.69,36.71 31.4,36.71 30.23,37.89 30.23,43.81 30.36,43.94 v30.74,43.94
  Bottom 0.152: CH5.MP R18.1 30.67,39.85 30.99,39.85 30.99,36.96 31.63,36.31 ESD5.3
ADC1_IN_5-  (via drill 0.38)
  Top 0.152: ADC3.46 56.39,36.2 56.66,36.2 v56.83,36.36 | v32.12,41.49 32.45,41.16 32.45,39.32 31.83,38.7 R28.2 31.59,38.6 31.59,36.8 34.77,36.8 35.14,37.16 v36.13,37.16
  Route2 0.152: v56.83,36.36 56.8,36.4 56.51,36.4 55.93,36.99 55.93,37.45 55.55,37.83 49.32,37.83 49.02,38.13 49,38.13 48.74,38.38 46.39,38.38 46.01,38 36.86,38 36.12,37.26 v36.12,37.17 v36.13,37.16
  Bottom 0.152: R19.2 31.52,39.94 31.52,40.88 v32.12,41.49
ADC1_IN_6+  (via drill 0.38)
  Top 0.152: ADC3.39 55.66,32.5 56.05,32.5 56.1,32.45 v56.74,32.45 | v30.1,36.8 28.86,36.8 27.69,37.97 CH6.MP
  Route2 0.152: v56.74,32.45 56.16,32.45 54.23,34.38 54.23,35.89 54.18,35.94 44.98,35.94 44.32,35.28 38.99,35.28 38.71,35.56 35.56,35.56 35.2,35.92 31.13,35.92 30.25,36.8 v30.1,36.8
  Route15 0.152: v32.64,34.16 30.1,36.7 v30.1,36.8
  Bottom 0.152: CH6.MP 27.69,41.54 28.39,40.84 28.39,39.75 27.69,39.05 R17.1 | ESD5.1 32.6,34.2 v32.64,34.16
ADC1_IN_6-  (via drill 0.38)
  Top 0.152: v57.48,32.73 57.19,33.02 ADC3.40 | v28.96,37.47 R29.2 29.9,39.64 29.9,41.97 v29.57,42.3
  Route2 0.152: v57.48,32.73 57.2,33.01 56.62,33.01 54.61,35.02 54.61,36.07 54.43,36.25 54.2,36.25 54.2,36.24 44.86,36.24 44.77,36.16 44.68,36.07 | v28.96,37.47 29.08,37.34 30.35,37.34 31.37,36.32 35.31,36.32 35.77,35.86 38.83,35.86 39.06,35.63 44.25,35.63 44.68,36.07 | 44.68,36.07
  Bottom 0.152: R18.2 29.26,38.7 29.26,42 v29.57,42.3
ADC1_IN_7+  (via drill 0.38)
  Top 0.152: ADC3.37 56.12,31.52 56.29,31.35 56.67,31.35 v56.69,31.36 | CH7.MP 25.4,46.1 27.3,46.1 30.35,43.05 30.35,38.05 30.77,37.63 30.77,36.2 31.9,35.07 31.9,33.8 v32.53,33.17 31.78,33.92 31.78,33.97 31.08,34.67 v30.86,34.67
  Route2 0.152: v56.69,31.36 v56.69,31.35 55.78,31.35 54.85,32.28 44.43,32.28 44.07,32.64 43.56,32.64 43.18,32.26 33.42,32.28 v32.53,33.17
  Bottom 0.152: CH7.MP 25.15,44.93 24.21,43.99 24.21,43.33 25.15,42.39 R16.1 | ESD4.4 29.73,36.19 29.85,36.07 29.85,35.89 29.81,35.85 29.81,35.41 29.85,35.37 29.85,34.93 30.1,34.67 v30.86,34.67
ADC1_IN_7-  (via drill 0.38)
  Top 0.152: ADC3.38 56.04,32.02 56.16,31.9 57.12,31.9 v57.46,31.57 | v30.35,35.63 29.6,36.38 28.73,36.38 R30.2 | 26.42,38.94 25.18,40.18 25.18,43.1 v25.69,43.1
  Top 0.305: 26.42,38.94 R30.2
  Route2 0.152: v57.46,31.57 57.12,31.9 56.16,31.9 53.93,34.14 53.93,35.43 53.72,35.63 45.13,35.63 44.48,34.98 38.73,34.98 38.53,35.18 35.43,35.18 35.11,35.5 30.61,35.5 30.48,35.63 v30.35,35.63
  Bottom 0.152: R17.2 27.25,40.88 27.03,41.66 25.71,42.98 25.71,43.1
  Bottom 0.305: 25.71,43.1 v25.69,43.1
ADC2_IN_0+  (via drill 0.38)
  Top 0.152: ADC2.2 33.83,31.12 31.75,31.12 31.57,31.3 31.57,32.23 26.1,37.69 22.76,37.69 22.55,37.9 22.55,43.26 CH8.MP 24.61,43.31 v25.12,43.81
  Bottom 0.152: CH8.MP R15.1 | ESD4.6 29.12,35.31 28.83,35.31 28.7,35.44 28.7,36.44 26.99,38.15 26.99,40.7 26.97,40.74 26.93,40.8 26.94,40.86 26.86,41.17 25.15,42.88 25.15,43.81 v25.12,43.81
ADC2_IN_0-  (via drill 0.38)
  Top 0.152: ADC2.1 33.84,31.62 32.13,31.62 31.87,31.88 31.87,32.35 26.23,37.99 23.75,37.99 23.75,38.57 R31.2 24.87,39.69 24.87,41.78 v24.46,42.19
  Bottom 0.152: v24.46,42.19 24.31,42.04 24.31,39.54 R16.2
ADC2_IN_1+
  Top 0.152: ADC2.4 31.15,30.19 30.96,30.38 30.96,31.98 25.85,37.08 20.07,37.08 CH9.MP
  Bottom 0.152: CH9.MP R14.1 20.63,40.86 21.08,40.86 21.08,36.32 21.22,36.19 ESD4.3
ADC2_IN_1-  (via drill 0.38)
  Top 0.152: ADC2.3 33.82,30.61 31.62,30.61 31.26,30.97 31.26,32.1 25.98,37.39 21.42,37.39 21.34,37.47 R32.2 22.23,39.59 22.23,41.19 v21.18,42.24
  Bottom 0.152: v21.18,42.24 21.53,41.88 21.53,39.77 R15.2
ADC2_IN_2+  (via drill 0.38)
  Top 0.152: ADC2.10 31.24,27.19 | 31.24,27.19 30.72,27.19 30.36,27.56 30.36,31.73 25.63,36.45 17.4,36.45 17.27,36.58 17.27,42.67 CH10.MP | v31.24,27.56 31.24,27.19
  Route15 0.152: v31.24,33.74 30.35,32.86 30.35,27.56 v31.24,27.56
  Bottom 0.152: CH10.MP R13.1 | ESD4.1 27.56,35.02 27.56,34.04 27.85,33.74 v31.24,33.74
ADC2_IN_2-  (via drill 0.38)
  Top 0.152: ADC2.9 32.51,27.69 32,28.2 30.66,28.2 30.66,31.85 25.76,36.75 18.8,36.75 R33.2 19.75,39.65 19.75,41.92 v19.5,42.18
  Bottom 0.152: v19.5,42.18 19.22,41.9 19.22,39.54 R14.2
ADC2_IN_3+
  Top 0.152: ADC2.12 30.07,26.19 29.75,26.51 29.75,31.48 25.41,35.81 14.86,35.81 14.86,45.72 CH11.MP
  Bottom 0.152: ESD3.4 15.99,35.55 16,35.56 16,40.13 15.84,40.3 R12.1 CH11.MP
ADC2_IN_3-  (via drill 0.38)
  Top 0.152: ADC2.11 30.33,26.69 30.05,26.97 30.05,31.6 25.54,36.12 16.26,36.12 16.26,38.48 | 16.26,38.48 R34.2 | v15.75,42.16 15.75,41.79 15.55,41.59 15.55,39.18 16.26,38.48
  Bottom 0.152: R13.2 16.76,39.46 16.76,41.66 16.26,42.16 v15.75,42.16
ADC2_IN_4+  (via drill 0.38)
  Top 0.152: v44.96,30.97 44.48,31.44 43.57,31.44 43.31,31.19 ADC2.47 | v14.27,36.89 14.03,36.89 13.94,36.8 12.91,36.8 12.32,37.39 12.32,43.18 CH12.MP
  Route2 0.152: v44.96,30.97 44.58,31.35 36.8,31.35 36.29,30.84 35.84,30.84 35.06,31.62 32.09,31.62 26.29,37.42 14.8,37.42 v14.27,36.89
  Bottom 0.152: ESD3.6 14.36,34.55 14.35,34.54 14.27,34.63 v14.27,36.89 | CH12.MP R11.1
ADC2_IN_4-  (via drill 0.38)
  Top 0.152: ADC2.48 42.93,31.82 43.5,31.82 43.69,32 v43.89,32 | v13.11,37.44 13.11,38.09 R35.2 14.55,39.53 14.55,41.88 v14.29,42.14
  Route2 0.152: v43.89,32 43.56,32 43.48,31.92 32.21,31.92 26.42,37.72 13.39,37.72 v13.11,37.44
  Bottom 0.152: R12.2 14.09,39.59 14.09,41.94 v14.29,42.14
ADC2_IN_5+  (via drill 0.38)
  Top 0.152: ADC2.45 44.38,30.19 v44.49,30.31 | v10.03,42.42 10.03,45.72 CH13.MP
  Route2 0.152: v44.49,30.31 44.41,30.31 44.36,30.26 42.13,30.26 41.9,30.5 36.8,30.5 36.54,30.24 35.59,30.24 34.81,31.02 31.84,31.02 26.04,36.81 15.37,36.81 15.16,36.61 15.16,36.48 14.67,35.99 12.17,35.99 11.05,37.11 11.05,41.66 10.29,42.42 v10.03,42.42
  Bottom 0.152: R1.1 10.03,40.42 v10.03,42.42 | CH13.MP 9.91,43.31 11.05,42.16 11.05,36.96 11.94,36.07 12.91,36.07 ESD3.3
ADC2_IN_5-  (via drill 0.38)
  Top 0.152: v43.85,30.8 42.91,30.8 ADC2.46 | v12.17,36.76 11.81,36.76 11.18,37.4 R36.2 11.78,38.1 v11.78,37.72
  Route2 0.152: v43.85,30.8 36.68,30.8 36.42,30.54 35.72,30.54 34.94,31.32 31.96,31.32 26.17,37.11 15.24,37.11 14.86,36.73 14.86,36.61 14.54,36.29 12.64,36.29 v12.17,36.76
  Bottom 0.152: R11.2 11.78,38.03 v11.78,37.72
ADC2_IN_6+  (via drill 0.38)
  Top 0.152: ADC2.39 42.88,27.11 v44.2,27.11 | v10.16,37.3 10.16,40.51 CH14.MP
  Route2 0.152: v44.2,27.11 43.96,27.35 43.72,27.35 43.18,27.89 43.18,28.36 41.64,29.89 37.05,29.89 36.79,29.63 35.34,29.63 34.56,30.41 31.58,30.41 25.79,36.21 15.74,36.21 14.92,35.39 11.92,35.39 10.44,36.86 10.44,37.02 v10.16,37.3
  Route15 0.152: v16.64,34.04 13.43,34.04 v10.16,37.3
  Bottom 0.152: CH14.MP R10.1 | ESD3.1 13.94,34.04 v16.64,34.04
ADC2_IN_6-  (via drill 0.38)
  Top 0.152: ADC2.40 43.81,27.69 43.84,27.65 44.73,27.65 v44.75,27.67 | v8.51,37.34 8.51,38.57 R37.2 8.64,38.25 v9.4,37.49
  Route2 0.152: v44.75,27.67 44.31,27.67 44.29,27.65 43.84,27.65 43.53,27.97 43.53,28.44 41.77,30.19 36.93,30.19 36.67,29.93 35.47,29.93 34.69,30.72 31.71,30.72 25.92,36.51 15.61,36.51 14.79,35.69 12.05,35.69 10.75,36.99 10.75,37.77 10.52,38 9.17,38 v8.51,37.34
  Bottom 0.152: R1.2 9.4,38.19 v9.4,37.49
ADC2_IN_7+  (via drill 0.38)
  Top 0.152: v45.34,26.66 44.87,26.19 ADC2.37 | v4.83,42.67 CH15.MP
  Route2 0.152: v45.34,26.66 44.7,26.03 43.05,26.03 40.77,28.31 34.54,28.31 34.54,29.57 34.31,29.81 31.33,29.81 25.55,35.59 15.97,35.59 15.17,34.78 15.11,34.78 15.11,34.48 | v6.48,37.3 7.11,36.67 7.11,36.57 7.1,36.56 7.1,34.45 8.12,34.45 8.53,34.04 11.17,34.04 11.61,34.48 15.11,34.48 | v15.11,32.89 15.11,34.48
  Bottom 0.152: v6.48,37.3 6.1,37.69 5.68,37.69 5.68,39.44 R9.1 v4.83,42.67 | v15.11,32.89 15.02,32.8 ESD2.6
ADC2_IN_7-  (via drill 0.38)
  Top 0.152: ADC2.38 43.85,26.69 43.97,26.57 44.42,26.57 45.27,27.42 v45.61,27.42 | v7.37,37.25 7.37,37.43 R38.2
  Route2 0.152: v45.61,27.42 45.27,27.42 44.42,26.57 43.97,26.57 42.88,27.66 42.88,28.23 41.52,29.59 39.12,29.59 39.12,29.48 39.16,29.44 39.16,28.99 38.85,28.67 38.4,28.67 38.08,28.99 38.08,29.44 38.23,29.58 38.23,29.59 37.18,29.59 36.92,29.33 35.22,29.33 34.44,30.11 31.46,30.11 25.66,35.91 15.86,35.91 15.04,35.08 11.62,35.08 9.9,36.8 8.29,36.8 7.84,37.25 v7.37,37.25
  Bottom 0.152: R10.2 v7.37,37.25
ADC3_IN_0+
  Top 0.152: ADC1.2 13.34,31.19 13.34,33.27 12.23,34.38 12.23,34.39 12.15,34.47 11.53,34.47 11.07,34.01 8.53,34.01 6.86,35.69 CH16.MP R39.2
  Bottom 0.152: CH16.MP 6.86,35.69 8.13,34.42 R8.1 9.11,33.06 9.22,32.94 12.7,32.94 12.84,32.8 ESD2.4
ADC3_IN_0-  (via drill 0.38)
  Top 0.152: v5.08,37.34 5.08,36.7 11.3,36.7 11.3,35.74 13.71,33.33 13.71,31.69 ADC1.1 v18.03,33.4 | R40.2 v18.16,17.91
  Route15 0.152: v18.16,17.91 18.16,33.4 v18.03,33.4
  Bottom 0.152: v5.08,37.34 4.95,37.34 4.83,37.47 R9.2
ADC3_IN_1+
  Top 0.152: ADC1.4 12.36,30.19 12.06,29.89 8,29.89 6.1,31.8 CH17.MP
  Bottom 0.152: R7.1 9.02,31.88 | 9.02,31.88 7.37,31.88 CH17.MP | ESD2.3 13.22,31.77 12.57,32.41 12.57,32.59 9.02,32.59 9.02,31.88
ADC3_IN_1-  (via drill 0.38)
  Top 0.152: ADC1.3 13.03,30.69 13.03,32.69 v11.81,33.91 | R42.2 10.58,35.51 v10.03,34.97
  Bottom 0.152: v11.81,33.91 11.21,33.91 R8.2 10.16,34.97 v10.03,34.97
ADC3_IN_2+  (via drill 0.38)
  Top 0.152: ADC1.10 13.93,27.19 11.68,29.44 9.25,29.44 8.89,29.08 7.75,29.08 v7.49,29.34 6.22,30.61 CH18.MP
  Bottom 0.152: v7.49,29.34 R6.1 9.14,28.32 10.97,28.32 11.44,27.85 13.75,27.85 14.22,28.31 ESD2.1
ADC3_IN_2-  (via drill 0.38)
  Top 0.152: ADC1.9 17.39,27.69 17.23,27.52 14.18,27.52 12.82,28.89 v12.82,29.1 | R44.2 11.81,33.15 11.81,31.91 v11.78,31.88
  Bottom 0.152: R7.2 v11.78,31.88 12.52,31.88 12.52,30.61 12.83,30.61 12.83,29.11 v12.82,29.1
ADC3_IN_3+  (via drill 0.38)
  Top 0.152: ADC1.12 16.26,26.19 | 16.26,26.19 12.29,26.19 11.56,26.92 6.35,26.92 6.1,27.18 CH19.MP | v16.26,25.18 16.26,26.19
  Bottom 0.152: R5.1 8.98,26.92 7.24,26.92 CH19.MP | ESD1.6 16.09,25.18 16.13,25.15 16.22,25.15 v16.26,25.18
ADC3_IN_3-  (via drill 0.38)
  Top 0.152: ADC1.11 17.04,26.69 17.02,26.67 13.77,26.67 12.2,28.24 12.2,28.47 v11.87,28.47 | v11.88,30.63 10.73,30.63 R46.2
  Bottom 0.152: R6.2 10.99,29.34 v11.87,28.47 11.83,28.5 11.83,30.58 v11.88,30.63
ADC3_IN_4+  (via drill 0.38)
  Top 0.152: ADC1.47 27.05,31.31 29.34,31.31 29.34,28.83 29.24,28.74 v28.07,28.74 | CH20.MP 4.19,24.89 v5.72,24.89
  Route2 0.152: v28.07,28.74 26.92,27.59 26.92,23.75 12.7,23.88 6.73,23.88 v5.72,24.89
  Bottom 0.152: R4.1 8.51,24.26 | 8.51,24.26 6.67,24.26 6.64,24.29 6.31,24.29 v5.72,24.89 | ESD1.4 13.21,25.91 12.43,25.91 12.32,26.02 11.81,26.02 11.7,25.91 8.51,25.91 8.51,24.26
  Bottom 0.305: ESD1.4
ADC3_IN_4-  (via drill 0.38)
  Top 0.152: ADC1.48 27.12,31.69 v27.69,32.26 | v12.32,27.3 11.68,27.3 11.43,27.56 11.21,27.56 R48.2
  Route2 0.152: v27.69,32.26 27.43,32.26 26.54,31.37 26.67,31.37 25.91,30.61 25.91,24.64 14.69,24.64 14.73,24.67 13.72,24.67 12.32,26.07 v12.32,27.3
  Bottom 0.152: v12.32,27.3 12.32,26.8 R5.2
ADC3_IN_5+  (via drill 0.38)
  Top 0.152: ADC1.45 27.72,30.19 v27.81,30.1 | CH21.MP 7.06,22.02 v7.06,21.29
  Route2 0.152: v7.06,21.29 7.37,21.59 22.48,21.59 22.73,21.34 30.55,21.34 30.61,25.02 30.48,25.15 28.83,25.15 28.83,27.05 28.58,27.3 28.19,27.3 28.19,28.1 28.61,28.51 28.61,28.74 29.24,28.74 29.34,28.83 29.34,30.1 v27.81,30.1
  Bottom 0.152: R3.1 7.49,21.72 v7.06,21.29 7.06,20.85 12.99,20.85 12.99,23.1 ESD1.3
ADC3_IN_5-  (via drill 0.38)
  Top 0.152: ADC1.46 27.05,30.81 28.62,30.81 v28.7,30.73 | v12.07,25.4 10.83,25.4 R50.2
  Route2 0.152: v28.7,30.73 26.54,30.73 26.54,24.81 26.58,24.8 26.04,24.26 13.21,24.26 v12.07,25.4
  Bottom 0.152: v12.07,25.4 10.92,24.26 R4.2
ADC3_IN_6+  (via drill 0.38)
  Top 0.152: v28.19,26.67 28.19,26.7 27.83,27.07 27.05,27.07 ADC1.39
  Bottom 0.152: CH22.MP 6.6,20.45 7.62,19.43 | 7.62,19.43 7.62,16.76 23.93,16.76 29.44,22.28 29.44,25.43 v28.19,26.67 | 7.62,19.43 7.87,19.18 R2.1 9.11,19.77 9.4,20.07 14.22,20.07 ESD1.1
ADC3_IN_6-  (via drill 0.38)
  Top 0.152: 29.97,22.1 29.97,25.02 28.74,26.26 28.74,26.89 28.42,27.21 28.16,27.21 27.68,27.69 ADC1.40 | 29.97,22.1 | 29.97,22.1 v30.01,21.97 | v12.32,22.58 11.91,22.99 R52.2
  Route2 0.152: v30.01,21.97 28.61,23.37 13.46,23.37 12.68,22.58 v12.32,22.58
  Bottom 0.152: v12.32,22.58 12.32,21.59 10.83,21.59 R3.2
ADC3_IN_7+  (via drill 0.38)
  Top 0.152: CH23.MP 6.1,18.8 27.64,18.8 28.8,19.96 v28.8,24.03 28.8,25.3 28.42,25.69 27.83,25.69 27.45,26.07 27.05,26.07 ADC1.37
  Route2 0.152: v44.61,38.86 44.61,39.59 44.64,39.62 45.34,39.62 46.74,41.02 46.74,43.12 v47.97,44.36 | v32.13,24.46 32.13,24.33 32.16,24.31 32.16,24.11 33.17,24.11 33.38,24.31 45.03,24.3 45.03,24.97 v45.09,25.02
  Route15 0.152: v32.13,24.46 31.67,24 28.83,24 v28.8,24.03
  Bottom 0.152: v45.09,25.02 45.85,25.02 46.61,25.78 46.61,27.82 46.45,27.97 45.24,27.97 45.24,29.66 45.97,30.4 45.97,32.26 44.96,33.27 44.96,34.04 44.2,34.8 42.38,34.8 42.38,37.34 44.42,37.34 44.42,38.83 44.45,38.86 v44.61,38.86 | ESD7.6 47.25,43.64 v47.97,44.36
ADC3_IN_7-  (via drill 0.38)
  Top 0.152: R54.2 11.56,20.45 v12.57,19.43 16.26,19.43 v16.26,20.73 | v16.19,17.31 16.35,17.31 16.51,17.14 27.05,17.14 29.46,19.56 29.46,25.07 28.5,26.04 27.91,26.04 27.58,26.36 27.58,26.65 27.54,26.69 ADC1.38
  Bottom 0.152: v12.57,19.43 12.32,19.18 R2.2 | v16.19,17.31 16.26,17.37 v16.26,20.73
AGND-SUBJECTGROUND
  Top 0.305: AGND_SELECT.3 1.65,7.88 1.65,6.99 11.91,6.99 12.41,7.48 12.41,9.12 AGND_SUB1.2V.2 12.8,9.52 C88.2
CS_ADC1  (via drill 0.38)
  Top 0.152: ADC3.18 47.93,28.25 46.99,27.3 v46.99,25.15 | BC832.A4 43.42,8.25 43.97,8.25 43.97,10.49 44.53,11.05 44.53,16.3 44.29,16.54 44.29,16.99 44.61,17.31 44.66,17.31 44.83,17.48 48.26,17.48 49.31,18.53 v49.31,27.05
  Bottom 0.152: v49.31,27.05 47.76,27.05 47.72,27.09 47.27,27.09 46.99,26.8 v46.99,25.15
CS_ADC2  (via drill 0.38)
  Top 0.152: v43.31,11.81 43.31,9.57 BC832.A5 | v35.05,21.34 35.05,21.81 34.98,21.87 34.98,23.37 ADC2.18
  Bottom 0.152: v43.31,11.81 43.21,11.9 42.45,11.9 42.13,12.22 42.13,15.65 40.64,17.14 36.45,17.14 35.03,18.57 35.03,21.31 v35.05,21.34
CS_ADC3  (via drill 0.38)
  Top 0.152: ADC1.18 19.23,19.99 19.05,19.81 v19.05,19.43 | BC832.C1 40.41,5.27 39.36,5.27 39.3,5.32 v39.28,5.32
  Route15 0.152: v19.05,19.43 19.72,18.76 26.58,18.76 39.28,6.06 v39.28,5.32
DRDY_ADC1  (via drill 0.38)
  Top 0.152: ADC3.30 53.93,26.71 v53.98,26.67 | v47.5,10.18 47.42,10.26 44.6,10.26 44.58,10.24 44.58,5.87 BC832.A2
  Route15 0.152: v53.98,26.67 58.42,26.67 58.42,10.14 47.5,10.14 v47.5,10.18
DRDY_ADC2  (via drill 0.38)
  Top 0.152: v40.07,8.8 40.07,8.68 39.81,8.41 BC832.D4 | v41.15,20.07 41.15,23.45 ADC2.30
  Route15 0.152: v40.07,8.8 40.15,8.8 40.39,9.04 40.51,9.04 40.51,11.81 40.73,12.03 40.74,12.03 41.06,12.35 41.06,19.97 v41.15,20.07
DRDY_ADC3  (via drill 0.38)
  Top 0.152: ADC1.30 25.23,20.24 25.27,20.19 25.23,20.19 v25.21,20.21 | v42.8,5.46 42.8,5.27 BC832.B1
  Route15 0.152: v25.21,20.21 25.64,20.21 25.88,19.97 27.08,19.97 37.08,9.97 37.08,9.4 39.43,7.05 39.73,7.05 41.11,5.67 42.59,5.67 v42.8,5.46
GND  (via drill 0.38)
  Top 0.305: 22.68,31.84 22.73,31.88 ADC1.56 22.77,32.34 22.77,31.84 | 21.59,26.42 v22.48,27.3 ADC1.65 24.23,29.69 ADC1.44 26.88,29.65 26.38,29.65 26.04,29.3 26.04,28.69 | 21.59,26.42 21.59,26.8 v22.48,25.91 21.59,25.91 21.59,26.42 | v19.56,30.99 19.56,31.22 20.23,31.89 | 20.23,31.89 ADC1.61 | 20.23,31.89 ADC1.60 20.73,31.72 20.83,31.62 22.47,31.62 22.61,31.76 | 22.61,31.76 22.75,31.62 23.11,31.62 23.07,31.66 22.95,31.66 22.77,31.84 | v36.07,31.38 36.06,31.37 35.12,31.37 34.65,31.84 34.65,32.34 ADC2.64 34.6,33.09 v33.66,34.04 | ADC2.60 36.32,32.39 | 36.32,32.39 ADC2.61 | v36.07,31.38 36.07,30.23 ADC2.65 | 36.07,32 36.07,32.14 36.32,32.39 | v36.07,31.38 36.07,32 | ADC2.22 37.08,23.51 37.08,24 | 37.08,30.99 36.07,32 | 37.08,28.45 37.08,30.99 | ADC2.31 41.6,26.47 37.08,30.99 | ADC1.31 25.73,24.18 25.53,24.38 21.34,24.38 | 21.34,24.38 20.85,24.38 21.23,24 | 18.18,24.54 ADC1.15 ADC1.14 18.84,25.19 19.3,25.65 19.27,25.69 ADC1.13 | 18.18,24.54 18.29,24.43 18.29,24.38 18.22,24.38 ADC1.16 15.89,22.05 13.56,22.05 13.56,22.08 v13.61,22.13 | ADC1.22 21.23,24 | 21.23,24 21.23,24.28 21.34,24.38 | 26.04,28.69 25.93,28.69 21.24,24 21.23,24 | 26.04,28.69 ADC1.42 | ADC2.65 35.1,24.69 | 35.1,24.69 ADC2.15 | ADC2.65 35.6,25.19 ADC2.14 | ADC2.7 33.92,28.7 35.05,28.7 35.81,27.94 37.97,27.94 | 35.41,25.69 35.05,26.05 35.05,29.69 ADC2.5 | 37.08,24.64 37.08,28.45 | 37.08,28.45 40.13,31.5 40.13,32.36 ADC2.53 | 37.08,24 41.77,28.69 | 41.77,28.69 ADC2.42 | 37.08,24 37.08,24.64 | 37.08,24.64 v38.29,25.84 | v38.29,25.84 38.29,26.23 41.78,29.72 42.78,29.72 ADC2.44 44.61,29.69 44.96,29.34 45.72,29.34 46.28,29.9 46.28,30.02 ADC3.15
  Top 0.305: 36.41,24.69 37.06,24.04 37.06,24.03 37.08,24 | 36.41,24.69 35.1,24.69 | 36.41,24.69 35.41,25.69 | 35.41,25.69 ADC2.13 ADC2.14 | ADC1.7 18.91,28.69 18.92,28.7 18.95,28.68 | 18.95,28.68 21.02,26.61 18.95,24.54 18.18,24.54 | ADC3.15 49.53,30.02 49.93,29.62 ADC3.22 49.93,26.57 v49.88,26.51 | ADC3.65 48.43,30.52 ADC3.14 ADC3.13 54.32,31.02 54.74,30.61 54.43,30.3 ADC3.31 54.43,27.23 55.12,26.54 58.38,26.54 58.38,19.69 55.12,19.69 J1.3 53.59,21.21 50.42,21.21 50.42,18.42 52.71,18.42 52.72,18.4 52.92,18.4 54.05,17.27 J1.5 v56.52,17.27 | 48.03,35.03 48.13,34.93 48.13,34.04 48.12,34.02 ADC3.7 45.97,34.02 45.84,34.15 45.52,34.15 45.51,34.16 v45.51,34.26 | 48.03,35.03 48.01,35.05 48.9,35.05 49.02,35.18 48.93,35.27 ADC3.61 | 48.03,35.03 ADC3.5 | ADC3.65 53.98,33.27 54.74,34.04 54.75,34.02 ADC3.42 57.03,34.02 57.15,34.15 57.39,34.15 57.79,34.54 57.79,35.18 v57.66,35.31 57.64,35.29 56.51,35.29 56.25,35.02 ADC3.44 | ADC3.65 53.98,30.48 53.98,29.84 53.68,29.55 47.16,29.55 47.13,29.52 ADC3.16 ADC3.15 | ADC3.61 48.93,36.67 49.02,36.58 51.31,36.58 51.44,36.7 | ADC3.61 48.93,36.99 48.26,36.32 51.44,36.32 | ADC3.53 52.88,37.68 52.88,37.17 52.71,37 | 51.44,36.32 52.03,36.32 52.71,37 | ADC3.61 ADC3.60 | ADC2.65 37.97,27.94 | v41.91,28.07 41.91,28.55 41.77,28.69 | v38.62,29.21 37.97,28.56 37.97,27.94 | v48.13,39.24 48.26,39.24 48.51,38.99 48.93,38.99 ADC3.61 | 22.77,31.84 22.73,31.88 22.73,33.4 22.18,33.4 22.18,33.58 21.84,33.92 v21.84,34.54 21.84,35.18 24.08,35.18 24.08,33.45 24.26,33.27 ADC1.53 | BC832.1 48.84,1.67 USB.M2 48.39,2.12 48.39,4.44 49.42,4.44 USB.M3 51.18,4.97 51.18,7.87 51.31,8 51.82,8 51.82,6.99
  Top 0.305: USB.M1 57.91,2.15 57.91,5.08 57.49,5.08 USB.M4 56.52,4.1 56.52,7.11 | 56.52,7.11 v56.52,7.86 | USB.5 51.82,4.17 51.82,6.99 | 51.82,6.99 51.94,7.11 56.52,7.11 | J1.9 56.39,12.19 v56.52,12.32 | C55.1 36.11,12.87 36.2,12.95 R64.1 | C55.1 35.18,13 35.18,14.35 | 35.18,14.35 C19.1 | 34.42,14.35 33.76,14.35 VCC3.3_DIG.3 33.37,14.74 33.37,15 32.89,15.47 VCC3.3_DIG.7 | 34.42,14.35 35.18,14.35 | 29.46,8.17 29.46,7.49 29.34,7.37 v27.43,7.37 | v27.43,4.62 27.49,4.67 C63.2 28.45,3 C56.1 25.5,2.92 CLOCK.2 25.11,1.27 21.46,1.27 | C3.1 30.94,11.94 30.23,11.94 30.1,11.81 v30.1,11.44 v30.09,11.43 v29.09,11.43 v29.08,11.44 | v30.1,10.2 30.18,10.29 31.62,10.29 | 31.62,10.29 32.13,10.29 32.26,10.41 C5.2 32.81,11.99 32.89,12.07 32.89,12.7 33.05,12.86 R65.1 35.04,12.86 C55.1 | v29.08,6.6 33.02,6.6 CHARGER.4 CHARGER.5 CHARGER.6 | 29.46,8.17 30.77,8.17 30.99,8.38 C76.2 31.6,8.48 31.62,8.51 31.62,10.29 | 29.46,8.17 ADR4525.4 | 21.46,1.27 20.48,1.27 C75.1 20.37,1.32 20.16,1.32 19.69,1.79 v19.69,1.91 | 12.7,6.48 C57.2 16.86,5.49 16.97,5.39 v16.97,3.05 VCC3.3_AN.2 | 12.7,6.48 12.7,7.11 12.87,7.28 AGND_SUB1.2V.3 13.72,11.2 C88.1 13.36,12.02 11.64,12.02 11.21,11.59 11.24,11.59 v11.36,11.71 | V_SWITCH.3 6.96,6.33 7.11,6.48 12.7,6.48 | RESET.2 22.48,7.43 22.48,3.05 21.34,1.91 21.34,1.4 21.46,1.27 | CHARGER.6 31.37,4.57 v31.37,4.68 | v31.46,3.45 32.2,3.45 CHARGER.8 | v39.84,34.41 38.6,34.41 ADC2.56 38.61,31.5 38.35,31.24 ADC2.65 | ADC1.7 18.74,28.69 18.75,28.68 18.95,28.68 | 18.76,29.47 18.76,29.59 18.9,29.74 18.95,29.69 ADC1.5 | ADC1.7 18.76,28.69 18.83,28.76 18.83,29.39 18.76,29.47 | 18.76,29.47 18.58,29.65 15.29,29.65 v15.24,29.59 13.74,29.59 13.72,29.57 v13.65,29.63
  Top 0.305: ADC2.15 ADC2.16 33.9,22.64 v34.44,22.1 | ADC2.15 ADC2.14 | 34.42,14.35 v34.42,17.02 | R71.1 43.05,14.76 43.05,17.32 41.46,17.32 41.46,17.31 41.46,14.81 R70.1 41.25,15.39 40.13,16.51 39.88,16.51 v39.84,16.55 | CHARGER.6 33.53,4.57 CHARGER.17 34.04,4.57 CHARGER.15 | v38.29,25.84 34.56,25.84 34.45,25.74 33.93,25.74 v32.89,24.71 | 51.44,36.7 51.44,36.32 | 51.44,37.16 51.44,37.47 51.48,37.42 51.48,37.17 51.66,37 52.71,37 | 51.44,37.16 51.44,36.7 | ADC1.56 22.68,32.34 22.68,31.84 | 22.68,31.84 22.61,31.76 | 22.61,31.76 v22.61,31.5 | ADC2.65 v38.35,27.43 | 51.44,37.16 51.43,37.16 ADC3.56
  Route2 0.305: v19.69,1.91 19.69,3.05 v16.97,3.05 | v31.37,4.68 31.48,4.57 33.4,4.57 33.4,3.68 33.15,3.43 31.37,3.43 31.39,3.45 v31.46,3.45 | v39.84,16.55 38.74,17.65 34.54,17.65 34.42,17.53 v34.42,17.02
  Route15 0.305: v53.4,32.88 54.45,33.93 56.58,33.93 57.53,34.29 57.53,35.18 v57.66,35.31
  Bottom 0.305: C67.1 20.45,27.71 C83.1 19.74,27 C51.1 20.83,27.13 22.3,27.13 v22.48,27.3 22.4,27.3 C39.1 22.45,28.12 C40.1 | C40.1 23.16,29.59 C31.1 | C31.1 23.99,30.42 23.99,30.53 24.23,30.78 C84.1 | C38.2 24.59,27.26 C87.2 25.02,27.08 C82.1 25.02,28.22 23.4,28.22 23.16,28.46 C40.1 | C31.1 22.73,30.1 | 22.73,30.1 C37.2 | C9.2 23.5,25.1 23.5,25.4 22.86,26.04 22.48,26.04 v22.48,25.91 22.35,26.04 21.77,26.04 21.77,25.97 21.46,25.65 20.75,25.26 C13.1 | C78.2 C74.1 39.09,30.2 38.86,29.97 C28.2 C25.1 | C85.1 C86.2 | C85.1 22.61,31.21 v22.61,31.5 22.12,31.98 22.12,33.65 21.84,33.92 v21.84,34.54 21.84,35.69 26.67,35.69 | C26.2 36.05,30.93 36.05,31.04 36.07,31.06 v36.07,31.38 | C72.1 36.83,27.94 | 36.83,27.94 36.83,27.13 C29.1 35.74,27 C64.1 | 36.83,27.94 36.88,27.99 C24.1 38.15,27.43 v38.35,27.43 | C25.1 39.42,29.46 C30.1 39.16,29.08 38.73,29.08 38.62,29.2 v38.62,29.21 | v38.29,25.84 38.35,25.78 39.62,25.78 39.88,25.53 39.88,25.1 C6.2 C10.1 | C25.1 40.24,30.29 40.24,30.41 40.48,30.65 C77.1 | C27.2 40.31,27.21 C71.2 C73.1 41.3,28.07 v41.91,28.07 | 49.02,32.59 50.2,32.59 C16.1 | 49.02,32.59 48.26,32.59 C79.1 47.3,33.75 46.78,34.27 45.53,34.27 v45.51,34.26 | C70.1 48.59,32.16 C21.1 49.02,32.59 | C69.1 C81.2 53.92,31.7 C8.2 52.9,31.52 50.55,31.52 50.42,31.64 C16.1 | C66.2 C65.1 51.26,35.67 C11.2 C2.1 | C68.1 52.37,35.38 C2.1 | C4.2 51.82,29.89 51.82,30.61 49.15,30.61 49.15,30.05 C14.2 48.94,29.72 49.26,29.4 49.26,29.41 49.44,29.23 49.53,29.23 49.53,27.7 49.93,27.31 49.93,26.8 49.88,26.75 v49.88,26.51 | C17.1 52.07,33.61 52.07,32.89 50.5,32.89 C16.1 | C1.2 47.8,36.83 48.9,36.83 48.9,37.59 48.39,38.1 48.39,39.5
  Bottom 0.305: v48.13,39.24 48.39,39.5 | C2.1 52.12,34.54 C17.1 | v56.52,7.86 v56.52,12.32 v56.52,17.27 | v27.43,7.37 v27.43,4.62 | v30.1,11.44 v30.1,10.2 | v29.08,11.44 v29.08,6.6 | ESD7.2 49.39,42.75 48.99,42.75 48.91,42.67 48.77,42.67 48.77,41.4 48.39,41.02 48.39,39.5 | ESD6.2 40.19,35.69 40.19,34.76 v39.84,34.41 | 15.37,29.59 18.8,29.59 19.35,30.15 C32.2 19.35,30.78 v19.56,30.99 | 15.37,29.59 v15.24,29.59 | ESD3.2 13.38,35 12.98,35 12.8,34.83 12.8,34.28 12.95,34.12 12.95,33.53 15.75,33.53 15.75,32.38 15.62,32.26 15.24,32.26 15.24,29.72 15.37,29.59 | v34.42,17.02 34.42,22.1 v34.44,22.1 | v33.66,34.04 33.78,34.16 33.78,35.81 ESD5.2 32.56,35.77 32.15,35.77 31.88,35.49 31.88,33.02 27.73,33.02 26.67,34.08 26.67,35.69 | ESD4.2 26.67,35.69 | C17.1 52.44,33.34 52.44,33.22 52.61,33.04 53.32,33.04 53.4,32.96 v53.4,32.88 | C85.1 22.73,30.89 22.73,30.1 | v32.89,24.71 36.82,24.71 C12.1 | v11.36,11.71 12.1,12.45 ADC_REF.GND | ESD1.2 13.72,22.93 13.61,22.83 v13.61,22.13 | v13.65,29.63 13.65,30.16 13.72,30.23 ESD2.2
  other vias: 40.36,21.34
  pour Top: 0.03,47.88 0.03,4.8 -0.03,4.75 13.94,4.75 16.05,6.86 16.05,16.56 42.8,16.56 50.14,23.9 58.85,23.9 58.88,23.93 58.88,48.26 58.39,48.74 58.39,48.84 0.99,48.84
  pour Route2: 0.05,7.62 2.49,5.18 12.17,5.18 22.15,15.16 23.27,15.16 24.97,13.46 24.97,8.76 35.53,8.76 35.56,8.79 35.56,11.56 36.86,12.85 38.81,12.85 42.9,16.94 42.9,19.61 51.54,28.24 58.34,28.24 58.34,48.36 1.17,48.36 0.25,47.45 0.25,7.65 0.2,7.59
  pour Bottom: 0.74,47.96 0.33,47.55 0.33,15.75 12.55,15.75 15.01,18.21 29.39,18.21 31.27,20.09 46.48,20.09 52.15,25.76 58.67,25.76 58.67,47.22 57.33,48.56 1.42,48.56 1.12,48.26
GROUNDSUBJECT_OUT
  Top 0.305: AGND_SELECT.4 AGND_SELECT.5 AGND_SELECT.6 10.5,14.27 10.46,14.28 9.37,15.37 2.41,15.37 2.31,15.47 2.31,15.86 1.27,16.9 1.27,47.37 1.91,48.01 33.02,48.01 33.43,47.6 48.79,47.6 SUBJECT_GND.MP
  Bottom 0.305: ESD7.1 50.55,44.41 SUBJECT_GND.MP
N$1  (via drill 0.38)
  Top 0.152: ADC3.59 49.91,37.74 49.91,38.73 v49.78,38.86
  Bottom 0.152: C1.1 49.78,36.88 v49.78,38.86
N$2  (via drill 0.38)
  Top 0.152: v37.47,20.57 37.47,21.32 37.6,21.46 ADC2.23
  Bottom 0.152: C12.2 38.05,24.72 37.47,24.13 v37.47,20.57
N$3  (via drill 0.38)
  Top 0.152: ADC2.49 42.1,32.92 v42.67,33.49
  Route2 0.152: v42.67,33.49 42.04,32.86 40.76,32.86 v40.01,33.6
  Route15 0.152: v55.75,40.01 55.75,41.38 40.79,41.38 v40.06,42.11
  Bottom 0.152: C74.2 39.91,31.12 39.91,33.5 v40.01,33.6 39.84,33.6 39.05,34.39 38.59,34.39 38.59,41.69 39.46,42.56 39.9,42.11 v40.06,42.11
  Bottom 0.305: R56.2 55.63,40.13 v55.75,40.01
N$4  (via drill 0.38)
  Top 0.152: ADC1.49 26.23,33.46
  Top 0.305: 26.23,33.46 26.18,33.51 26.18,33.53 v26.35,33.53 | v26.35,33.53
  Route2 0.152: v26.35,33.53 | v26.35,33.53 25.37,33.53 24.36,34.54 v23.47,34.54
  Route15 0.152: v56.64,38.73 56.13,38.73 55.5,39.37 54.48,39.37 53.59,40.26 52.06,40.26 51.54,39.18 50.94,38.23 26.16,38.23 26.16,33.71 v26.35,33.53
  Bottom 0.152: v23.47,34.54 23.59,34.42 23.59,31.19 C85.2
  Bottom 0.305: R59.2 57.53,39.62 v56.64,38.73
N$5  (via drill 0.38)
  Top 0.152: J1.6 53.85,15.88 58.15,15.88 58.15,8.76 50.93,8.76 48.23,6.07 BC832.5 46.33,6.07 46.99,6.73 v47.12,6.6 | v11.25,2.62 11.87,2.62 LED3.1
  Bottom 0.152: v47.12,6.6 46.36,7.36 38.08,7.36 37.02,6.3 37.02,1.02 19.3,1.02 19.16,1.16 19.16,1.69 18.82,2.03 11.68,2.03 11.18,2.54 v11.25,2.62
N$6  (via drill 0.38)
  Top 0.152: BC832.2 46.63,2.77 v46.74,2.67
  Top 0.305: LED1.1 10.25,1.4 v11.3,1.4
  Bottom 0.152: v11.3,1.4 11.3,0.71 37.16,0.71 37.42,0.97 37.42,6.27 38.11,6.96 46,6.96 46.74,6.22 v46.74,2.67
N$7
  Top 0.305: ADC3.64 ADC3.63
N$8  (via drill 0.38)
  Top 0.305: v53.98,38.99 53.98,37.72 ADC3.51
  Bottom 0.152: v53.98,38.99 53.98,35.89 C7.1
N$9  (via drill 0.38)
  Top 0.152: VCC3.3_AN.3 17.53,2.11 17.53,5.72 v17.02,6.22 | VCC3.3_DIG.4 33.66,16.78 33.66,17.51 v33.64,17.53
  Top 0.305: v5.46,5.72 V_SWITCH.2
  Bottom 0.152: v5.46,5.72 5.46,6.22 v17.02,6.22 17.02,16 17.27,16.26 32.37,16.26 v33.64,17.53
N$10
  Top 0.305: R68.1 11.98,4.44 12.57,4.44 12.7,4.31 LED3.2
N$11
  Top 0.305: R69.1 10.16,2.84 LED1.2
N$12  (via drill 0.38)
  Top 0.152: BC832.3 46.93,3.87 v47.37,3.43 | v52.58,23.75 52.58,22.48 J1.2
  Route2 0.152: v47.37,3.43 48.79,3.43 48.82,3.45 48.82,19.99 v52.58,23.75
N$13  (via drill 0.38)
  Top 0.152: ADC2.51 41.1,33.35 v41.26,33.5
  Bottom 0.152: v41.26,33.5 41.13,33.38 41.13,31.63 41.53,31.23
  Bottom 0.305: C15.1 41.53,31.06 41.53,31.23
N$14  (via drill 0.38)
  Top 0.152: v51.29,25.65 50.43,26.51 ADC3.23
  Bottom 0.152: C14.1 50.42,29.29 50.42,26.65 51.29,25.78 v51.29,25.65
N$15
  Top 0.152: BC832.4 48.5,4.97 48.51,4.95 48.71,5.15 48.71,6.11 51,8.4 58.46,8.4 58.46,18.51 53.76,18.51 J1.4
N$16  (via drill 0.38)
  Top 0.152: v21.59,20.45 21.59,21.34 21.73,21.48 ADC1.23
  Bottom 0.152: C13.2 21.67,24.34 21.46,24.13 21.46,20.57 v21.59,20.45
N$17  (via drill 0.38)
  Top 0.152: J1.10 52.83,11.81 52.83,9.27 52.63,9.07 50.8,9.07 49.99,8.25 v47.37,8.25 | v38.1,11.59 38.1,10.92 36.83,9.65 36.83,9.22 37.25,8.8 37.31,8.8 BC832.10 35.4,8.27 35.42,8.29 v35.27,8.29 | v20.45,7.62 18.98,7.62 RESET.1
  Route2 0.152: v35.27,8.29 35.27,8.19 35.16,8.08 33.91,8.08 33.91,9.4 33.28,9.4 33.12,9.24 30.83,9.24 30.73,9.14 26.54,9.14 26.42,9.27 24.13,9.27 24,9.14 24,7.75 23.75,7.49 20.45,7.49 v20.45,7.62
  Bottom 0.152: v38.1,11.59 41.18,8.51 47.17,8.51 47.37,8.31 v47.37,8.25
N$18  (via drill 0.38)
  Top 0.152: VCC3.3_DIG.6 32.24,18.18 32,18.42 | 32,18.42 35.18,18.42 C19.2 | 32,18.42 28.83,18.42 26.92,16.51 26.92,15.49 v27.05,15.49 | v27.3,1.65 28.03,1.65 28.54,1.14
  Top 0.305: CHARGER.11 CHARGER.10 33.53,1.14 31.12,1.14 31.12,2.92 C56.2 29.89,2.62 R63.2 28.54,1.14 28.54,0.72 15,0.72 | VCC3.3_AN.1 15.77,4.06 14.73,4.06 14.73,0.99 15,0.72 | 15,0.72 2.45,0.72 2.29,0.89 2.29,3.51 V_SWITCH.1
  Route15 0.152: v27.05,15.49 27.05,7.75 26.89,7.59 26.89,4.39 27.05,4.23 27.05,1.78 27.18,1.65 v27.3,1.65
N$19  (via drill 0.38)
  Top 0.305: VCC3.3_AN.4 18.54,2.01 v18.54,1.34 | v14.05,1.37 14.05,4.92 C57.1
  Bottom 0.305: v18.54,1.34 18.35,1.14 14.05,1.14 v14.05,1.37
N$20
  Top 0.305: ADC1.63 ADC1.64
N$21  (via drill 0.38)
  Top 0.152: v20.7,33.4 21.23,32.87 ADC1.59
  Bottom 0.152: C32.1 20.27,31.07 20.7,31.5 v20.7,33.4
N$22  (via drill 0.38)
  Top 0.152: ADC2.59 37.1,33.36 v36.78,33.36
  Bottom 0.152: v36.78,33.36 36.78,30.73
  Bottom 0.305: 36.78,30.73 C26.1
N$26  (via drill 0.38)
  Top 0.152: ADC1.51 25.23,34.21 25.4,34.37 v25.44,34.37
  Bottom 0.152: v25.44,34.37 25.25,34.18 25.25,31.35 C18.1
N$31  (via drill 0.38)
  Top 0.152: v32.77,28.32 32.89,28.19 ADC2.8 | ADC2.41 44.22,28.19 44.63,28.6 v44.68,28.6
  Route15 0.152: v54.72,40.12 53.84,41 46.72,41 45.34,39.62 44.17,39.62 v44.06,39.52
  Bottom 0.152: C71.1 41.35,26.72 41.57,26.72 43.01,28.17 44.25,28.17 v44.68,28.6 44.68,29.73 45.59,30.64 45.59,31.75 42.88,34.47 42.04,34.47 42.04,37.72 43.94,37.72 44.07,37.85 v44.07,39.51 | 35.61,26.47 35.4,26.47 35.05,26.81 35.05,28.19 32.89,28.19 v32.77,28.32
  Bottom 0.305: C71.1 40.97,26.34 C27.1 40.04,26.55 37.67,26.55 37.2,26.08 C29.2 36.4,26.39 C64.2 35.61,26.47 | R55.1 R56.1 54.65,42.84 54.61,42.8 54.61,40.39 54.8,40.2 v54.72,40.12 | v44.06,39.52 v44.07,39.51
N$38  (via drill 0.38)
  Top 0.152: ADC1.41 v29.21,28.19 | v14.86,28.19 18.24,28.19 ADC1.8
  Route2 0.152: v45.58,25.66 41.65,25.66 40.89,26.42 36.83,26.42 35.43,27.81 33.02,27.81 32.99,27.78 32.54,27.78 32.19,28.13 29.28,28.13 v29.21,28.19
  Route15 0.152: v56.52,39.52 56.53,39.5 57.53,39.5 58.33,38.7 58.33,33.69 58.04,33.4 58.04,28.07 55.38,28.07 55.34,28.1 46.52,28.1 46.61,28.01 46.61,26.42 46.23,26.42 45.58,25.77 v45.58,25.66
  Bottom 0.152: 19.61,26.47 19.4,26.47 19.05,26.81 19.05,28.19 v14.86,28.19 | 24.97,26.47 25.18,26.47 25.78,27.07 25.78,28.19 v29.21,28.19 | R59.1 57.49,42.8 56.64,42.8 56.64,39.5 56.53,39.5 v56.52,39.52
  Bottom 0.305: 19.61,26.47 C83.2 20.4,26.39 C51.2 21.08,26.08 21.59,26.59 23.75,26.59 C38.1 24.84,26.34 C87.1 24.97,26.47 | R58.1 R59.1
N$39  (via drill 0.38)
  Top 0.305: CHARGER.1 34.55,5.8 34.55,8.67 v34.65,8.78 | v32.89,9.78 32.89,10.75 R62.1 32.93,11.44 R65.2